# Altium project BEE_BOARD.PrjPcb (part 1 of 2)
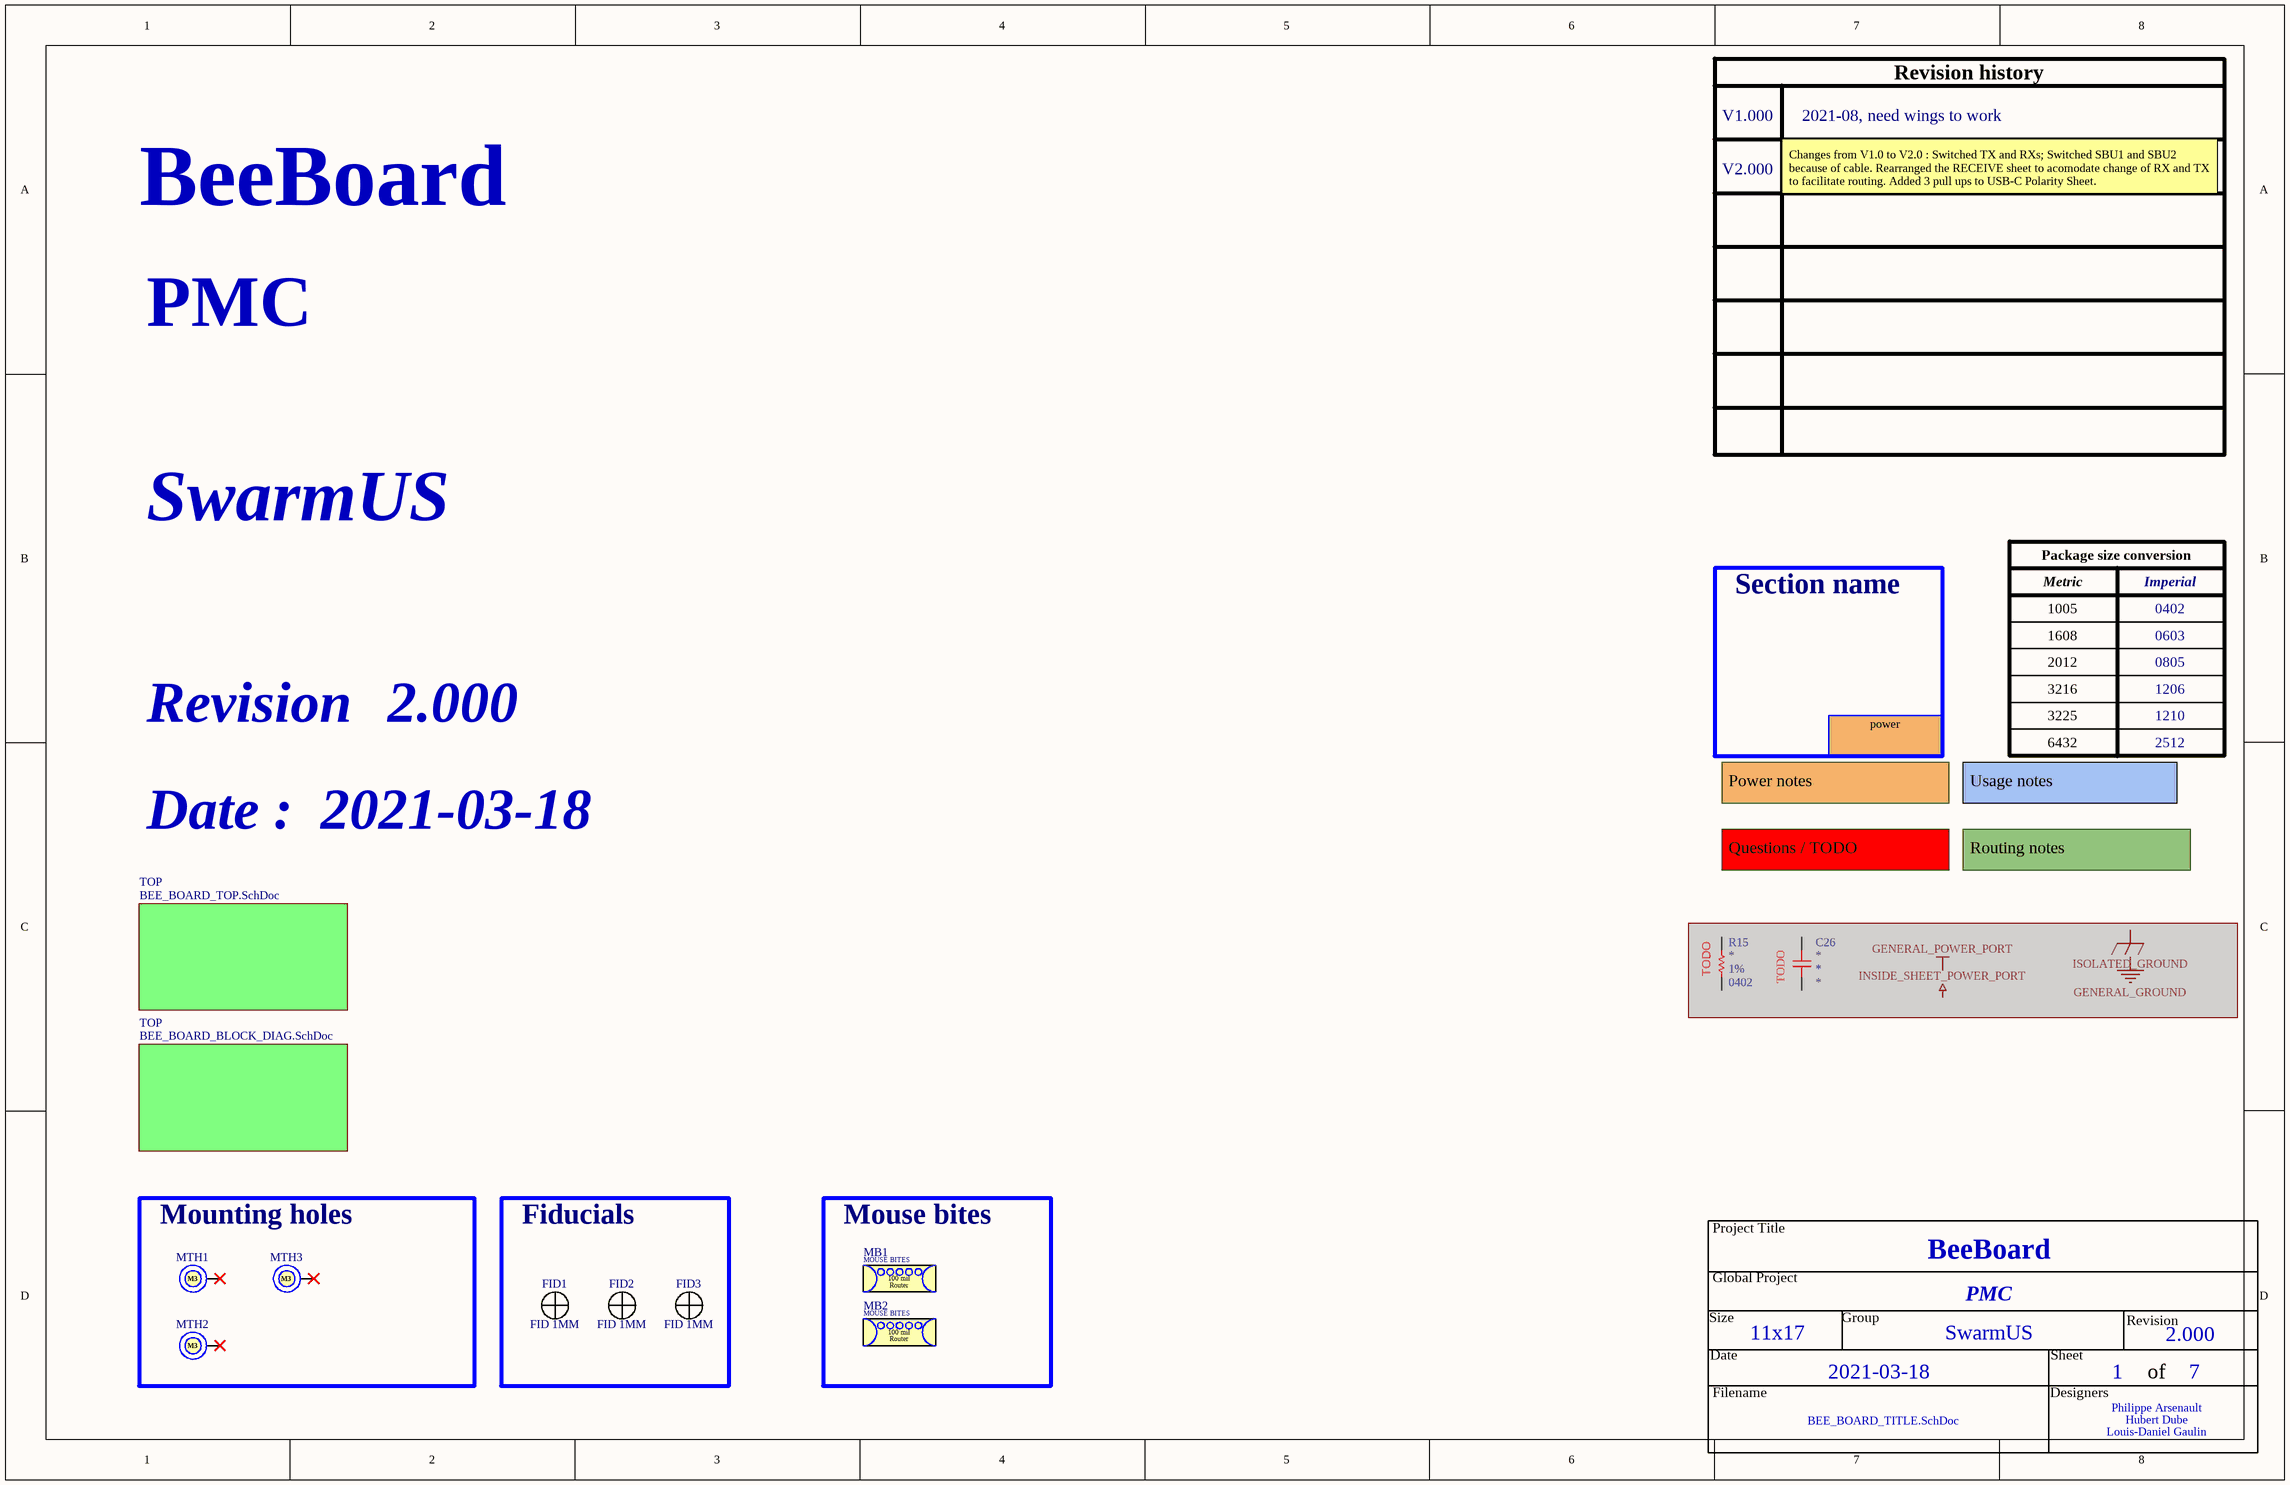
[diagram p0: BEE_BOARD_TITLE.SchDoc]
Project_Stencil_Top_Thickness: 0.1 MM; Project_Stencil_Bot_Thickness: 0.1 MM; Project_Revision: 2.000; Project_Name: BeeBoard; Project_Group: SwarmUS; Project_Global: PMC; Project_Designer3: Louis-Daniel Gaulin; Project_Designer2: Hubert Dube; Project_Designer1: Philippe Arsenault; Project_Date: 2021-03-18
7 sheets, 201 parts. Net scope: hierarchical (ports join the sheet entries above them; power ports are global).
Board file: BEE_BOARD.PcbDoc
Sheets:
  BEE_BOARD_TITLE.SchDoc
    TOP = BEE_BOARD_TOP.SchDoc
      POWER = BEE_BOARD_POWER.SchDoc
      RECEIVE = BEE_BOARD_RECEIVE.SchDoc
      DECAWAVE = BEE_BOARD_DECAWAVE.SchDoc
      POLARITY CHECK = BEE_BOARD_USB_C_POLARITY.SchDoc
    TOP = BEE_BOARD_BLOCK_DIAG.SchDoc

## Sheet BEE_BOARD_TITLE.SchDoc
size Tabloid; DocumentNumber: 1; SheetNumber: 1; SheetTotal: 7; Sheet_Name: Insert name in Document Parameters; Size: 11x17

### Parts
(Parts that share a designator on the sheet are numbered #1, #2 ... from top to bottom, then left to right.)
C26#1  PRELIM  [CAP_CER_1812]  (value not drawn)  (masked out: inside a compile mask, not in the netlist)
FID1  FID 1MM  [FID_CIRCLE_1MM]
FID2  FID 1MM  [FID_CIRCLE_1MM]
FID3  FID 1MM  [FID_CIRCLE_1MM]
MB1  MOUSE BITES  [PNL_MOUSEBITES_100MIL_5-HOLES]  (no BOM)
MB2  MOUSE BITES  [PNL_MOUSEBITES_100MIL_5-HOLES]  (no BOM)
MTH1  M3  [MTH_M3]  (no BOM)
MTH2  M3  [MTH_M3]  (no BOM)
MTH3  M3  [MTH_M3]  (no BOM)
R15#1  Tolerance: 1%  Package: 0402  [RES_0402]  (hidden comment: PRELIM)  (masked out: inside a compile mask, not in the netlist)

### Blocks framed on the sheet
Mounting holes: MTH1-MTH3
Fiducials: FID1-FID3
Mouse bites: MB1 MB2

### Sub-sheets
TOP = BEE_BOARD_TOP.SchDoc: no entries
TOP = BEE_BOARD_BLOCK_DIAG.SchDoc: no entries

### Nets

Not connected (* = marked no-connect by the designer): FID1 1 2; FID2 1 2; FID3 1 2; MTH1 1*; MTH2 1*; MTH3 1*

### Notes on the sheet
- V1.000
- 2021-08, need wings to work
- V2.000
- Changes from V1.0 to V2.0 : Switched TX and RXs; Switched SBU1 and SBU2 because of cable. Rearranged the RECEIVE sheet to acomodate change of RX and TX to facilitate routing. Added 3 pull ups to USB-C Polarity Sheet.
- Section name
- power
- Power notes
- Usage notes
- Questions / TODO
- Routing notes
- Revision history
- Package size conversion
- Metric
- 1005
- 1608
- Imperial
- 0402
- 0603
- Revision
- 2012
- 3216
- 0805
- 1206
- 3225
- 6432
- 1210
- 2512
- Date :
- Project Title
- Global Project
- Size
- Date
- Group
- Sheet
- of
- Filename
- Designers
- (in symbol CAP_CER_PRELIM) TODO
- (in symbol PNL_MOUSEBITES_100MIL_5-HOLES) 100 mil; Router
- (in symbol RES_PRELIM) TODO

### Library data of the parts
C26#1 = CAP_CER_PRELIM: CAP - CER PRELIM; Manufacturer #1: Würth Elektronik; Part Number #1: 885342211009; Tolerance: 10%; GRAMS Lib Spec: 2.8; Magnetic Material: Unknown; Polarized: No; Current Rating: *; Power Max: *; HelpURL: http://www.vishay.com/docs/45228/hvseries.pdf; CreatedBy/Date: Hubert Dube - 03/02/2021; Temperature: -55°C ~ 125°C; Manufacturer #2: *; Note: *; Assembly Type: SMD; Part Number #2: *; Cryo: UNKNOWN; Supplier 1: Digi-Key; Supplier Part Number 1: 732-12109-1-ND; Package: *; Voltage Rating: *; Value: *
FID1-FID3 = FID_CIRCLE_1MM: FID - FIDUCIAL 1MM CIRCLE DOUBLE-SIDED - 1MM; GRAMS Lib Spec: 2.8; Magnetic Material: NO; Cryo: UNKNOWN; Value: *; Tolerance: *; Voltage Rating: *; Current Rating: *; Power Max: *; HelpURL: https://www.pcb-3d.com/wordpress/wp-content/uploads/ipc-sm-782a_amendment_1_and_2.pdf; CreatedBy/Date: Jonathan Bouchard 2018-07-23; VerifiedBy: Caroline Paulin - 25 juillet 2018; Temperature: *; Package: 1MM CIRCLE; Manufacturer #1: *; Manufacturer #2: *; Note: *; Assembly Type: NONE; Part Number #2: *; Part Number #1: *; Polarized: *; Supplier 1: *; Supplier Part Number 1: *
MB1 MB2 = PNL_MOUSEBITES_100MIL_5-HOLES: PNL - MOUSE BITES 100 MIL - 5-TH; GRAMS Lib Spec: 2.8; Magnetic Material: NO; Rule: UNIONINDEX=0|RULEKIND=ComponentClearance|NETSCOPE=AnyNet|LAYERKIND=SameLayer|NAME=Schematic Component Clearance Constraint|GAP=0mil|COLLISIONCHECKMODE=3|VERTICALGAP=0mil|SHOWDISTANCES=FALSE|UNIT=Imperial; Rule: UNIONINDEX=0|RULEKIND=PlaneClearance|NETSCOPE=AnyNet|LAYERKIND=SameLayer|NAME=Schematic Power Plane Clearance|CLEARANCE=20mil|UNIT=Imperial; Cryo: UNKNOWN; Value: *; Tolerance: *; Voltage Rating: *; Current Rating: *; Power Max: *; HelpURL: *; CreatedBy/Date: Jonathan Bouchard 2019-04-15; VerifiedBy: Caroline Paulin - 24 mai 2019; Temperature: *; Package: *; Manufacturer #1: *; Manufacturer #2: *; Note: *; Assembly Type: NONE; Part Number #2: *; Part Number #1: *; Polarized: *; Supplier 1: *; Supplier Part Number 1: *
MTH1-MTH3 = MTH_M3: MTH - MOUNTING HOLE M3 PLATED - M3; GRAMS Lib Spec: 2.8; Magnetic Material: NO; Cryo: UNKNOWN; Value: *; Tolerance: *; Voltage Rating: *; Current Rating: *; Power Max: *; HelpURL: https://littlemachineshop.com/images/gallery/PDF/TapDrillSizes.pdf; CreatedBy/Date: Jonathan Bouchard 2018-07-23; VerifiedBy: Arnaud Samson 23-07-18; Temperature: *; Package: M3; Manufacturer #1: *; Manufacturer #2: *; Note: *; Assembly Type: NONE; Part Number #2: *; Part Number #1: *; Polarized: *; Supplier 1: *; Supplier Part Number 1: *
R15#1 = RES_PRELIM: RES -PRELIM; Manufacturer #1: Yageo; Part Number #1: RC0402FR-0775RL; GRAMS Lib Spec: 2.8c; Power Max: 1/16W; Magnetic Material: Unknown; Polarized: No; Voltage Rating: 50V; Assembly Type: SMD; CreatedBy/Date: Hubert Dubé - 3/02/2020; Current Rating: *; HelpURL: https://www.yageo.com/upload/media/product/productsearch/datasheet/rchip/PYu-RC_Group_51_RoHS_L_11.pdf; Manufacturer #2: *; Note: *; Part Number #2: *; Temperature: -55°C ~ 155°C; Value: *

## Sheet BEE_BOARD_TOP.SchDoc
size Tabloid; DocumentNumber: 3; SheetNumber: 3; SheetTotal: 7; Sheet_Name: Top; Size: 11x17
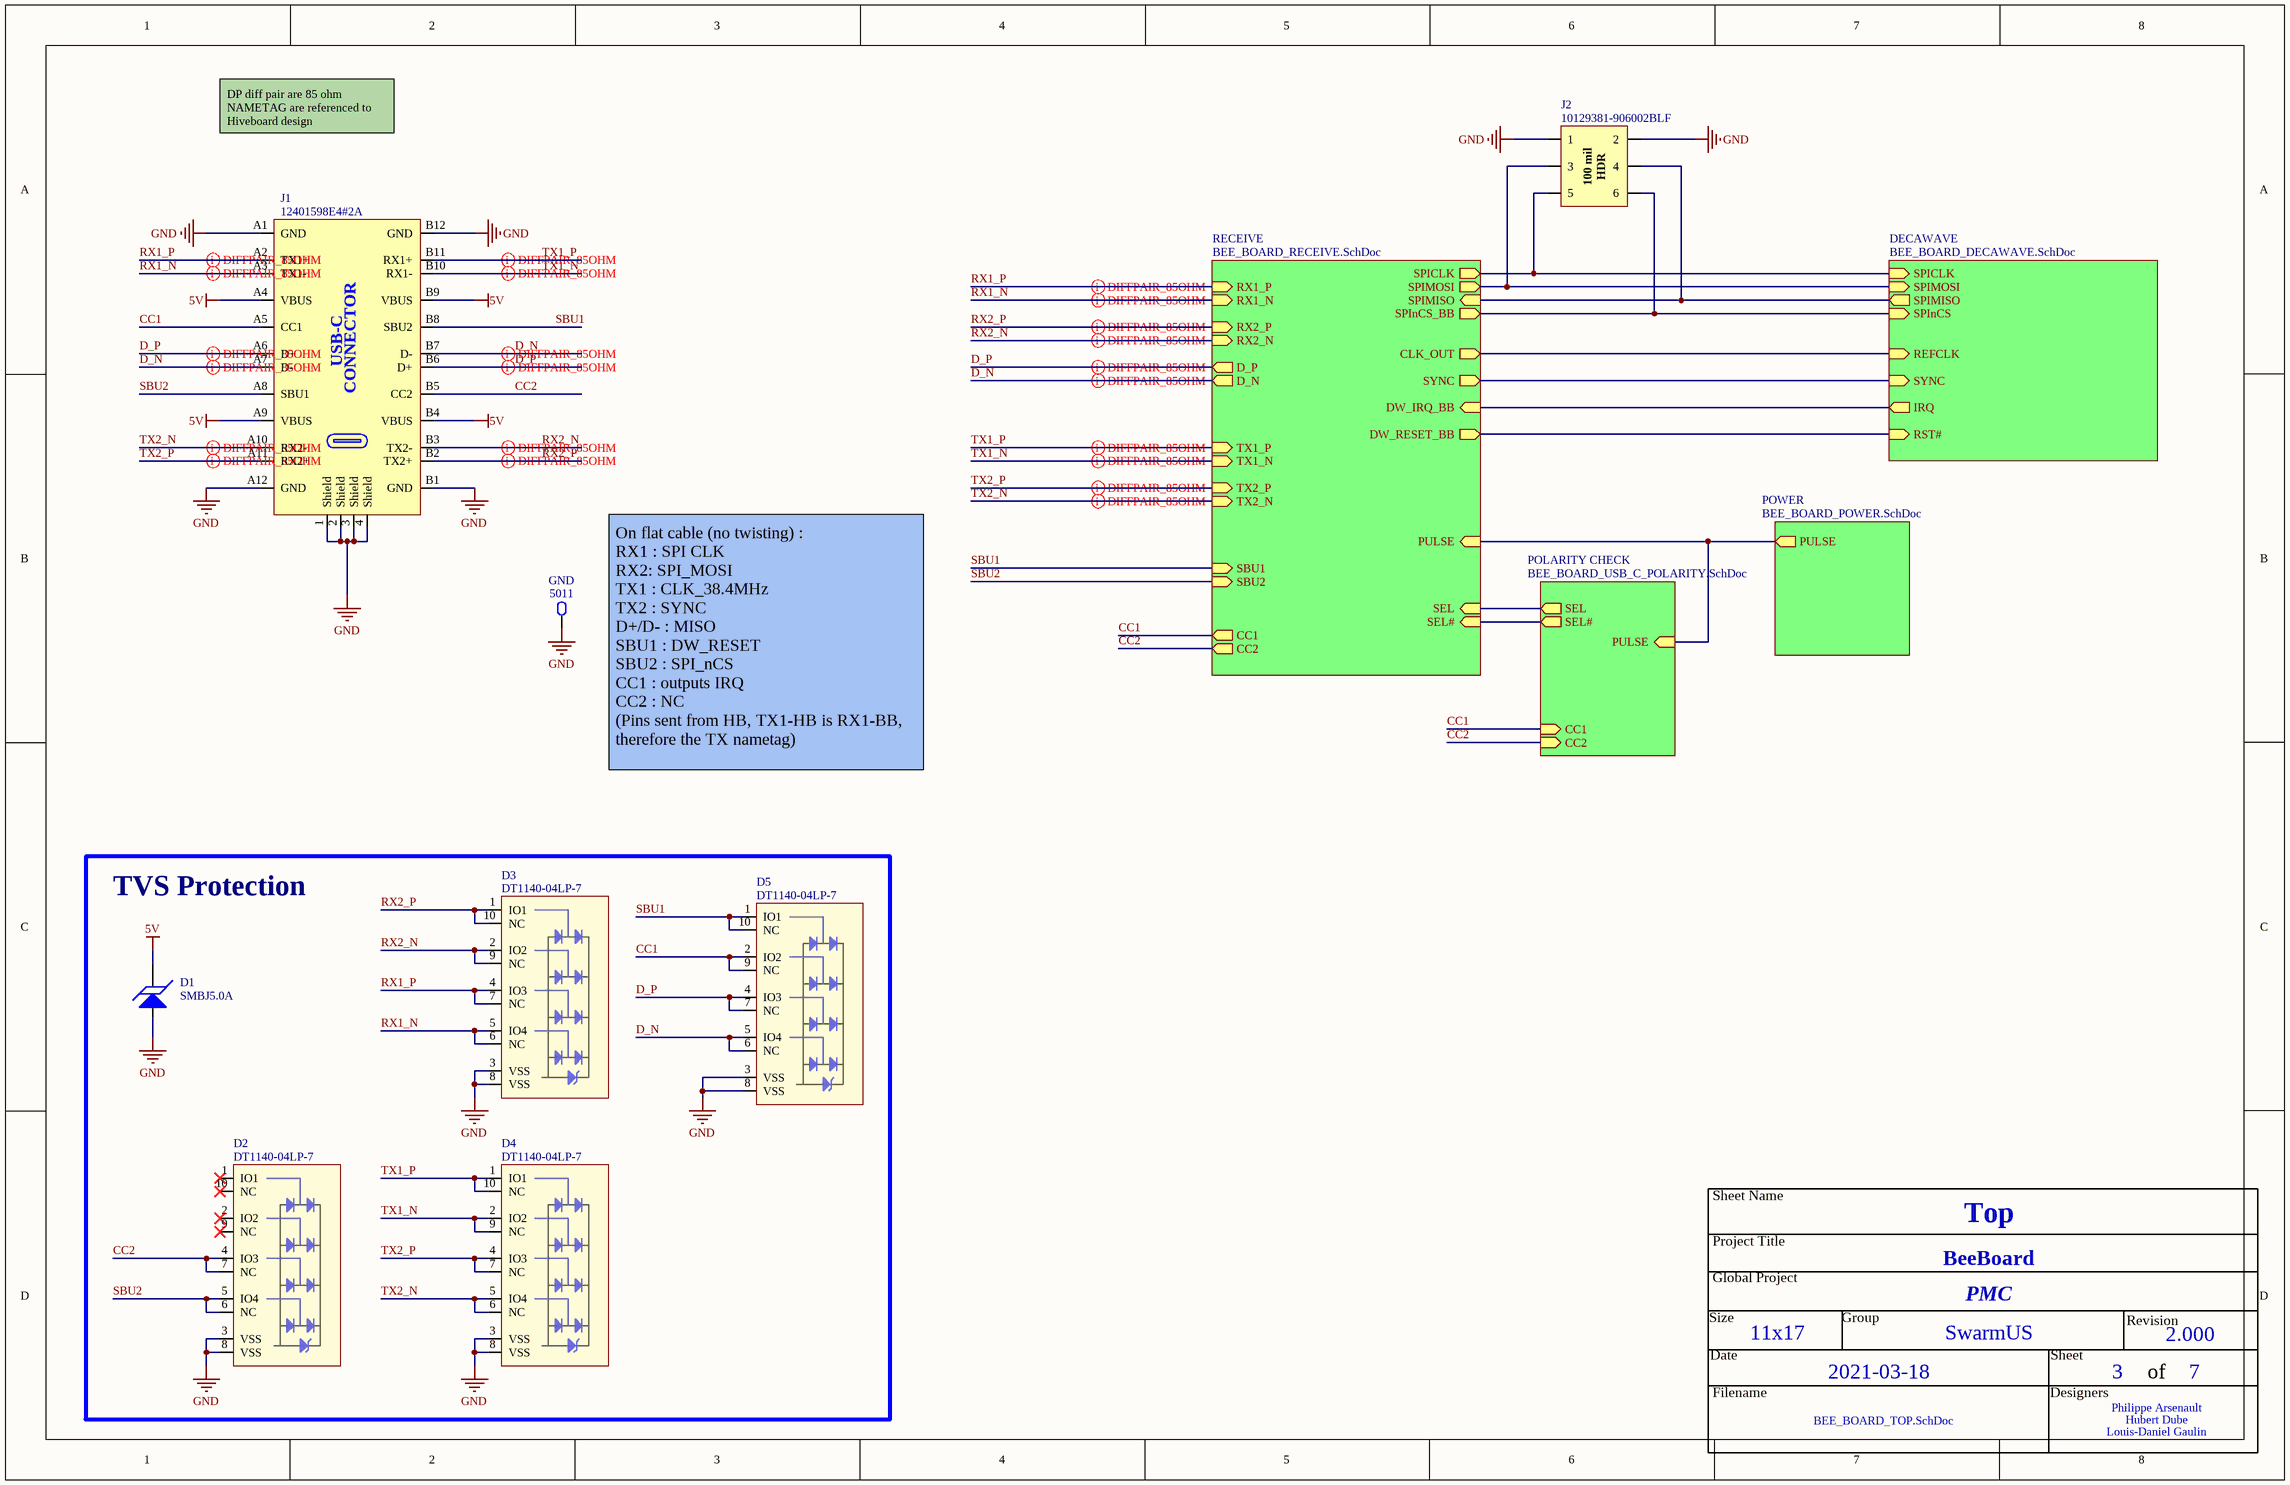
[diagram p1: BEE_BOARD_TOP.SchDoc]

### Parts
D1  SMBJ5.0A  [TVS_PWR_SMBJ5.0CA]
D2  DT1140-04LP-7  [TVS_DATA_DT1140-04LP-7]
D3  DT1140-04LP-7  [TVS_DATA_DT1140-04LP-7]
D4  DT1140-04LP-7  [TVS_DATA_DT1140-04LP-7]
D5  DT1140-04LP-7  [TVS_DATA_DT1140-04LP-7]
GND  5011  [TPO_5011]
J1  12401598E4#2A  [CON_USB_3.2_TypeC_12401598E4#2A]
J2  10129381-906002BLF  [CON_HDR_10129381-906002BLF]

### Blocks framed on the sheet
TVS Protection: D1-D5

### Sub-sheets
DECAWAVE = BEE_BOARD_DECAWAVE.SchDoc: SYNC (in), SPICLK (in), SPIMISO (out), SPIMOSI (in), RST# (in), REFCLK (in), SPInCS (in), IRQ (out)
POLARITY CHECK = BEE_BOARD_USB_C_POLARITY.SchDoc: CC1 (in), CC2 (in), SEL (out), PULSE (in), SEL# (out)
POWER = BEE_BOARD_POWER.SchDoc: PULSE (out)
RECEIVE = BEE_BOARD_RECEIVE.SchDoc: SPIMISO (in), SPIMOSI (out), SPICLK (out), CLK_OUT (out), SYNC (out), DW_IRQ_BB (in), SPInCS_BB (out), DW_RESET_BB (out), CC1 (out), CC2 (out), TX1_P (in), SBU2 (in), SEL (in), TX2_N (in), RX2_P (in), RX1_P (in), TX1_N (in), TX2_P (in), RX2_N (in), RX1_N (in), D_P (out), D_N (out), SBU1 (in), PULSE (in), SEL# (in)

### Nets
5V: D1.1 J1.A4(VBUS) J1.A9(VBUS) J1.B4(VBUS) J1.B9(VBUS)
GND: D1.2 D2.3(VSS) D2.8(VSS) D3.3(VSS) D3.8(VSS) D4.3(VSS) D4.8(VSS) D5.3(VSS) D5.8(VSS) GND.1 J1.1(Shield) J1.2(Shield) J1.3(Shield) J1.4(Shield) J1.A1(GND) J1.A12(GND) J1.B1(GND) J1.B12(GND) J2.1 J2.2
CC1: D5.2(IO2) D5.9(NC) J1.A5(CC1) ; sheet RECEIVE/CC1, sheet POLARITY CHECK/CC1
CC2: D2.4(IO3) D2.7(NC) J1.B5(CC2) ; sheet RECEIVE/CC2, sheet POLARITY CHECK/CC2
CLK_OUT: sheet RECEIVE/CLK_OUT, sheet DECAWAVE/REFCLK
D_N: D5.5(IO4) D5.6(NC) J1.A7(D-) J1.B7(D-) ; sheet RECEIVE/D_N
D_P: D5.4(IO3) D5.7(NC) J1.A6(D+) J1.B6(D+) ; sheet RECEIVE/D_P
DW_IRQ_BB: sheet RECEIVE/DW_IRQ_BB, sheet DECAWAVE/IRQ
DW_RESET_BB: sheet RECEIVE/DW_RESET_BB, sheet DECAWAVE/RST#
PULSE: sheet POWER/PULSE, sheet RECEIVE/PULSE, sheet POLARITY CHECK/PULSE
RX1_N: D3.5(IO4) D3.6(NC) J1.A3(TX1-) ; sheet RECEIVE/RX1_N
RX1_P: D3.4(IO3) D3.7(NC) J1.A2(TX1+) ; sheet RECEIVE/RX1_P
RX2_N: D3.2(IO2) D3.9(NC) J1.B3(TX2-) ; sheet RECEIVE/RX2_N
RX2_P: D3.1(IO1) D3.10(NC) J1.B2(TX2+) ; sheet RECEIVE/RX2_P
SBU1: D5.1(IO1) D5.10(NC) J1.B8(SBU2) ; sheet RECEIVE/SBU1
SBU2: D2.5(IO4) D2.6(NC) J1.A8(SBU1) ; sheet RECEIVE/SBU2
SEL: sheet RECEIVE/SEL, sheet POLARITY CHECK/SEL
SEL#: sheet RECEIVE/SEL#, sheet POLARITY CHECK/SEL#
SPICLK: J2.5 ; sheet RECEIVE/SPICLK, sheet DECAWAVE/SPICLK
SPIMISO: J2.4 ; sheet RECEIVE/SPIMISO, sheet DECAWAVE/SPIMISO
SPIMOSI: J2.3 ; sheet RECEIVE/SPIMOSI, sheet DECAWAVE/SPIMOSI
SPInCS: J2.6 ; sheet RECEIVE/SPInCS_BB, sheet DECAWAVE/SPInCS
SYNC: sheet RECEIVE/SYNC, sheet DECAWAVE/SYNC
TX1_N: D4.2(IO2) D4.9(NC) J1.B10(RX1-) ; sheet RECEIVE/TX1_N
TX1_P: D4.1(IO1) D4.10(NC) J1.B11(RX1+) ; sheet RECEIVE/TX1_P
TX2_N: D4.5(IO4) D4.6(NC) J1.A10(RX2-) ; sheet RECEIVE/TX2_N
TX2_P: D4.4(IO3) D4.7(NC) J1.A11(RX2+) ; sheet RECEIVE/TX2_P

Not connected (* = marked no-connect by the designer): D2 1(IO1)* 2(IO2)* 9(NC)* 10(NC)*

### Layout directives
differential pair; differential pair class DIFF_85: D_N, D_P, RX1_N, RX1_P, RX2_N, RX2_P
differential pair; differential pair class DIFF_85; net class TX: TX1_N, TX1_P, TX2_N, TX2_P

### Notes on the sheet
- DP diff pair are 85 ohm
  NAMETAG are referenced to Hiveboard design
- (near GND) On flat cable (no twisting) :
  RX1 : SPI CLK
  RX2: SPI_MOSI
  TX1 : CLK_38.4MHz
  TX2 : SYNC
  D+/D- : MISO
  SBU1 : DW_RESET
  SBU2 : SPI_nCS
  CC1 : outputs IRQ
  CC2 : NC
  (Pins sent from HB, TX1-HB is RX1-BB, therefore the TX nametag)
- Sheet Name
- Project Title
- Global Project
- Revision
- Size
- Date
- Group
- Sheet
- of
- Filename
- Designers
- (in symbol CON_HDR_10129381-906002BLF) 100 mil; HDR
- (in symbol CON_USB_3.2_TypeC_12401598E4#2A) USB-C; CONNECTOR

### Library data of the parts
D1 = TVS_PWR_SMBJ5.0A: TVS - BIDIR 5V 9.2V 600W - DO214AA; Manufacturer #1: Littelfuse Inc.; Value: Vbr = 6.4V -  Clamp = 9.2V; Voltage Rating: 5V Standoff; Current Rating: 100A (peak); Power Max: 600W (Pppm); GRAMS Lib Spec: 2.8c; Magnetic Material: UNKNOWN; Polarized: YES; Tolerance: *; HelpURL: https://www.littelfuse.com/~/media/electronics/datasheets/tvs_diodes/littelfuse_tvs_diode_smbj_datasheet.pdf.pdf; CreatedBy/Date: Louis-Daniel Gaulin / 13-04-2021; VerifiedBy: Philippe Arsenault/2021-04-14; Temperature: -65°C ~ 150°C (TJ); Package: DO214AA; Manufacturer #2: *; Note: *; Assembly Type: SMD; Part Number #2: *; Part Number #1: SMBJ5.0A; Supplier 1: Digi-Key; Supplier Part Number 1: SMBJ5.0ALFCT-ND; Cryo: UNKNOWN
D2-D5 = TVS_DATA_DT1140-04LP-7: TVS - DIODE 5.5V 10V - 10-UFDFN; Manufacturer #1: Diodes Incorporated; Value: 5.5V @ 1mA (Reverse Standoff); Voltage Rating: 6V (Breakdown); Current Rating: 6A (8/20µs); Power Max: 60W (8/20µs); GRAMS Lib Spec: 2.8; Note: Fooprint created from tpd4e05u06 (TI) for manufacturability (soldermask); Magnetic Material: Unknown; Polarized: Yes; Tolerance: -; HelpURL: https://www.diodes.com/assets/Datasheets/DT1140-04LP.pdf; CreatedBy/Date: Joël Lemay 2019-11-20; VerifiedBy: C.Paulin - 21/11/2019; Temperature: -55°C~85°C; Package: 10-UFDFN; Manufacturer #2: -; Assembly Type: SMD; Part Number #2: -; Part Number #1: DT1140-04LP-7; Supplier 1: Digi-Key; Supplier Part Number 1: DT1140-04LP-7DICT-ND; Cryo: UNKNOWN
GND = TPO_5011: TPO - TEST POINT - TH; Manufacturer #1: Keystone Electronics; Polarized: No; Magnetic Material: UNKNOWN; GRAMS Lib Spec: 2.8; Current Rating: *; Manufacturer #2: *; Note: *; Power Max: *; Value: *; Part Number #1: 5011; Part Number #2: *; HelpURL: https://www.keyelco.com/userAssets/file/M65p56.pdf; Assembly Type: TH; Package: *; CreatedBy/Date: Louis-Daniel Gauli / 02-11-2020; Temperature: *; Tolerance: *; VerifiedBy: Philippe Arsenault/2020-11-06; Voltage Rating: *; Cryo: UNKNOWN; Supplier 1: Digi-Key; Supplier Part Number 1: 36-5011-ND
J1 = CON_USB_3.2_TypeC_12401598E4#2A: CON_USB - USB 3.2 Gen 2 (USB 3.1 Gen 2, Superspeed + (USB 3.1)) 24 pos Receptacle - R/A; Manufacturer #1: Amphenol ICC (Commercial Products); Value: USB 3.2 Type C; Current Rating: 5A total; GRAMS Lib Spec: 2.8; Magnetic Material: Unknown; Polarized: Yes; Voltage Rating: -; Power Max: -; HelpURL: https://www.amphenol-icc.com/media/wysiwyg/files/drawing/12401598xxx2a.pdf; CreatedBy/Date: Louis-Daniel Gaulin / 07-04-2021; VerifiedBy: Philippe Arsenault/2021-04-08; Temperature: max 105°C; Package: SMD + TH R/A; Assembly Type: SMD + TH; Part Number #1: 12401598E4#2A; Supplier 1: Digi-Key; Supplier Part Number 1: 12401598E4#2ACT-ND
J2 = CON_HDR_10129381-906002BLF: CON - Header 6 positions 3x2  0.100" - 6-TH; Manufacturer #1: Amphenol ICC (FCI); Current Rating: 3A; GRAMS Lib Spec: 2.8c; Magnetic Material: Unknown; Polarized: Yes; Value: 6 Pos.; Assembly Type: TH; CreatedBy/Date: Philippe Arsenault/2021-04-14; HelpURL: https://cdn.amphenol-icc.com/media/wysiwyg/files/drawing/10129381.pdf; Manufacturer #2: *; Package: 6- TH; Part Number #2: *; Power Max: *; Temperature: -55°C ~ 105°C; Tolerance: *; Part Number #1: 10129381-906002BLF; Cryo: UNKNOWN; Supplier 1: Digi-Key; Supplier Part Number 1: 10129381-906002BLF-ND

## Sheet BEE_BOARD_POWER.SchDoc
size Tabloid; DocumentNumber: 4; SheetNumber: 4; SheetTotal: 7; Sheet_Name: POWER; Size: 11x17
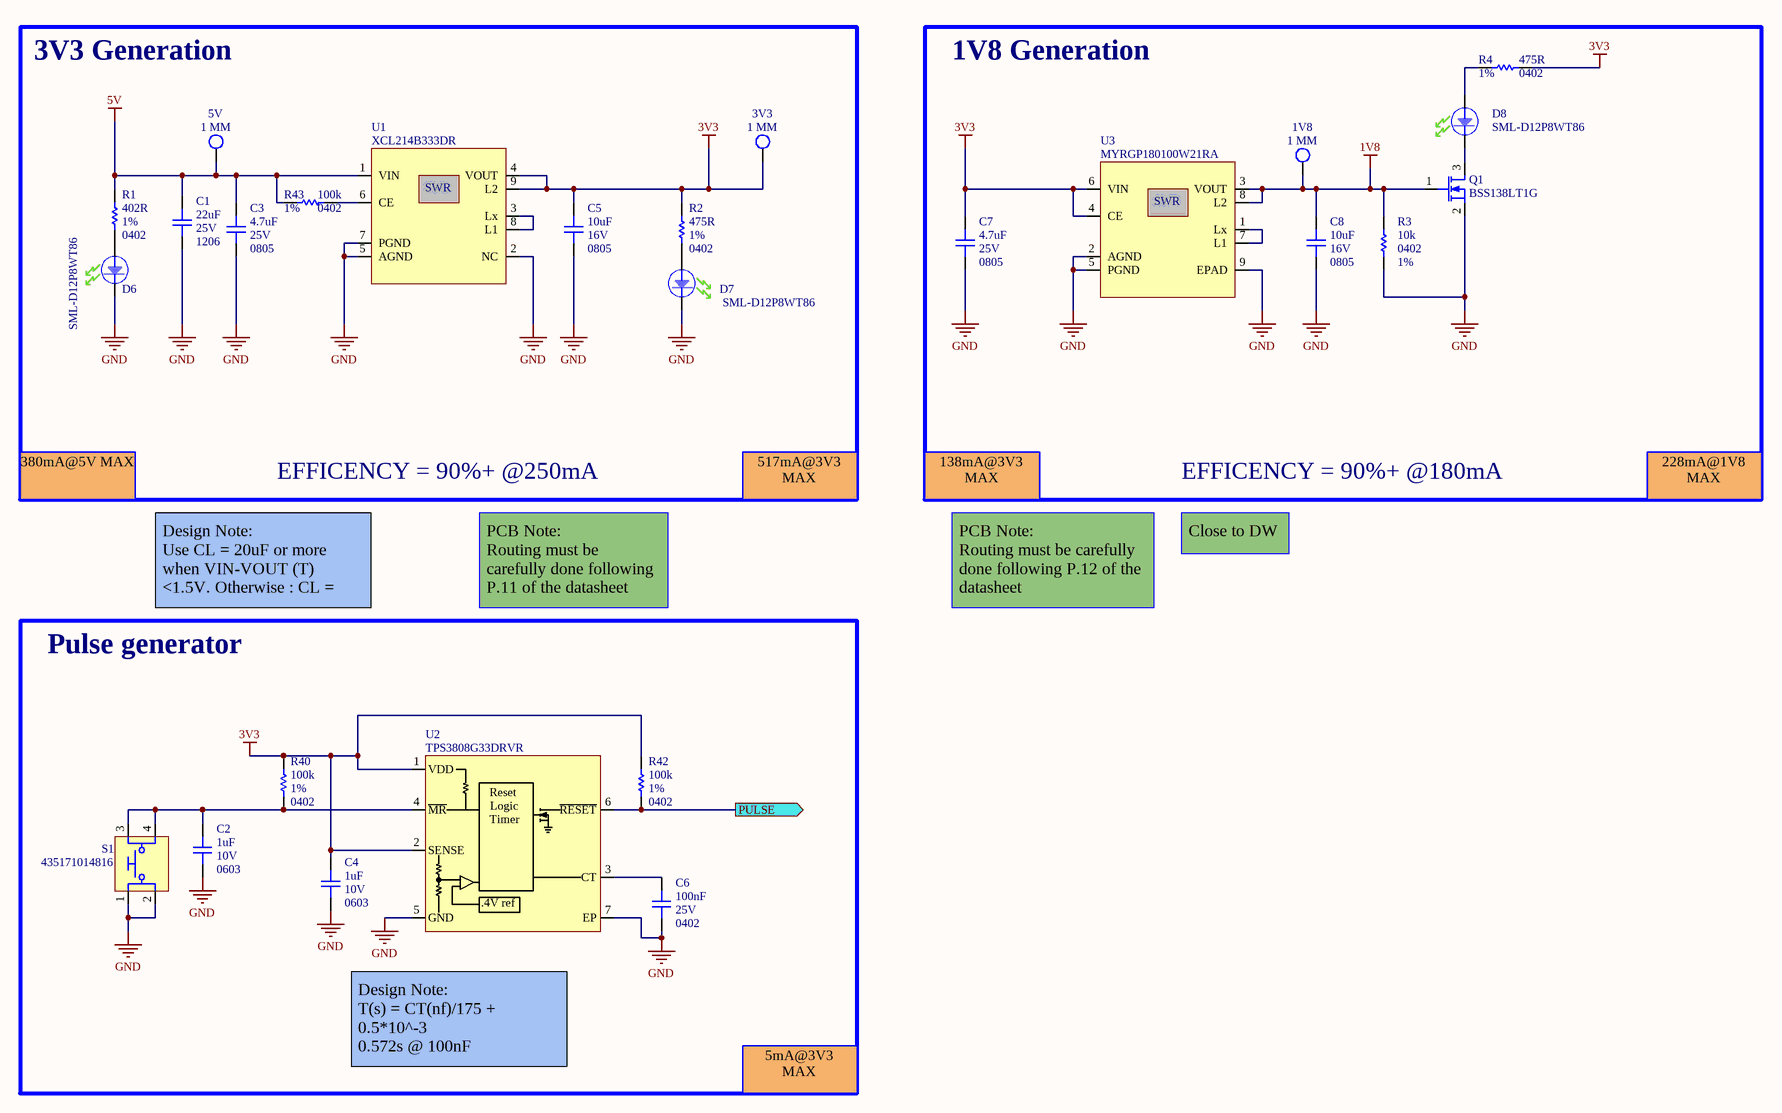
[diagram p2: BEE_BOARD_POWER.SchDoc]

### Parts
1V8  1 MM  [TPO_SMD_ROUND_1MM]  (no BOM)
3V3  1 MM  [TPO_SMD_ROUND_1MM]  (no BOM)
5V  1 MM  [TPO_SMD_ROUND_1MM]  (no BOM)
C1  value 22uF  Package: 1206  Voltage Rating: 25V  [CAP_CER_1206]  (hidden comment: CL31A226KAHNNNE)
C2  value 1uF  Package: 0603  Voltage Rating: 10V  [CAP_CER_0603]  (hidden comment: C0603C105K8PACTU)
C3  value 4.7uF  Package: 0805  Voltage Rating: 25V  [CAP_CER_0805]  (hidden comment: C2012X7R1E475K125AE)
C4  value 1uF  Package: 0603  Voltage Rating: 10V  [CAP_CER_0603]  (hidden comment: C0603C105K8PACTU)
C5  value 10uF  Package: 0805  Voltage Rating: 16V  [CAP_CER_0805]  (hidden comment: GRM21BR61C106KE15K)
C6  value 100nF  Package: 0402  Voltage Rating: 25V  [CAP_CER_0402]  (hidden comment: CGA2B3X7R1E104K050BB)
C7  value 4.7uF  Package: 0805  Voltage Rating: 25V  [CAP_CER_0805]  (hidden comment: C2012X7R1E475K125AE)
C8  value 10uF  Package: 0805  Voltage Rating: 16V  [CAP_CER_0805]  (hidden comment: GRM21BR61C106KE15K)
D6  SML-D12P8WT86  [LED_SML-D12P8WT86]
D7  SML-D12P8WT86  [LED_SML-D12P8WT86]
D8  SML-D12P8WT86  [LED_SML-D12P8WT86]
Q1  BSS138LT1G  [TRX_NMOS_BSS138LT1G]
R1  value 402R  Tolerance: 1%  Package: 0402  [RES_0402]  (hidden comment: ERJ-2RKF4020X)
R2  value 475R  Tolerance: 1%  Package: 0402  [RES_0402]  (hidden comment: ERJ-2RKF4750X)
R3  value 10k  Tolerance: 1%  Package: 0402  [RES_0402]  (hidden comment: RC0402FR-0710KL)
R4  value 475R  Tolerance: 1%  Package: 0402  [RES_0402]  (hidden comment: ERJ-2RKF4750X)
R40  value 100k  Tolerance: 1%  Package: 0402  [RES_0402]  (hidden comment: RC0402FR-07100KL)
R42  value 100k  Tolerance: 1%  Package: 0402  [RES_0402]  (hidden comment: RC0402FR-07100KL)
R43  value 100k  Tolerance: 1%  Package: 0402  [RES_0402]  (hidden comment: RC0402FR-07100KL)
S1  435171014816  [SWI_TACT_435171014816]
U1  XCL214B333DR  [REG_SWR_XCL214B333DR]
U2  TPS3808G33DRVR  [POW_TPS3808G33DRVR]
U3  MYRGP180100W21RA  [REG_SWR_MYRGP180100W21RA]

### Blocks framed on the sheet
3V3 Generation: 3V3 5V C1 C3 C5 D6 D7 R1 R2 R43 U1
1V8 Generation: 1V8 C7 C8 D8 Q1 R3 R4 U3
Pulse generator: C2 C4 C6 R40 R42 S1 U2

### Ports
PULSE (out)

### Nets
1V8: 1V8.1 C8.2 Q1.1(G) R3.1 U3.3(VOUT) U3.8(L2)
3V3: 3V3.1 C4.1 C5.2 C7.2 R2.2 R4.1 R40.2 R42.2 U1.4(VOUT) U1.9(L2) U2.1(VDD) U2.2(SENSE) U3.4(CE) U3.6(VIN)
5V: 5V.1 C1.2 C3.2 R1.2 R43.2 U1.1(VIN)
GND: C1.1 C2.2 C3.1 C4.2 C5.1 C6.1 C7.1 C8.1 D6.K D7.K Q1.2(S) R3.2 S1.1 S1.2 U1.2(NC) U1.5(AGND) U1.7(PGND) U2.5(GND) U2.7(EP) U3.2(AGND) U3.5(PGND) U3.9(EPAD)
PULSE: R42.1 U2.6(~{RESET}) ; port PULSE
NetC2_1: C2.1 R40.1 S1.3 S1.4 U2.4(~{MR})
NetC6_2: C6.2 U2.3(CT)
NetD6_A: D6.A R1.1
NetD7_A: D7.A R2.1
NetD8_A: D8.A R4.2
NetD8_K: D8.K Q1.3(D)
NetR43_1: R43.1 U1.6(CE)
NetU1_3: U1.3(Lx) U1.8(L1)
NetU3_1: U3.1(Lx) U3.7(L1)

### Notes on the sheet
- 380mA@5V MAX
- EFFICENCY = 90%+ @250mA
- 517mA@3V3 MAX
- 138mA@3V3 MAX
- EFFICENCY = 90%+ @180mA
- 228mA@1V8 MAX
- Design Note:
  Use CL = 20uF or more when VIN-VOUT (T) <1.5V. Otherwise : CL = 10uF
- PCB Note:
  Routing must be carefully done following P.11 of the datasheet
- PCB Note:
  Routing must be carefully done following P.12 of the datasheet
- Close to DW
- Design Note:
  T(s) = CT(nf)/175 + 0.5*10^-3
  0.572s @ 100nF
- 5mA@3V3
  MAX
- Sheet Name
- Project Title
- Global Project
- Size
- Group
- Revision
- Date
- Sheet
- of
- Filename
- Designers
- (in symbol POW_TPS3808G33DRVR) Reset; Logic; Timer; .4V ref
- (in symbol REG_SWR_MYRGP180100W21RA) SWR
- (in symbol REG_SWR_XCL214B333DR) SWR

### Library data of the parts
1V8 3V3 5V = TPO_SMD_ROUND_1MM: TPO - TEST POINT ROUND SMD PAD ONLY  - 1 MM; Magnetic Material: NO; GRAMS Lib Spec: 2.8; Cryo: UNKNOWN; Current Rating: *; Manufacturer #1: *; Manufacturer #2: *; Note: *; Power Max: *; Value: *; Part Number #1: *; Part Number #2: *; HelpURL: *; Polarized: *; Supplier 1: *; Assembly Type: NONE; Supplier Part Number 1: *; Package: 1 MM ROUND; CreatedBy/Date: Jonathan Bouchard 2018-07-17; Temperature: *; Tolerance: *; VerifiedBy: Arnaud Samson 23-07-18; Voltage Rating: *
C1 = CAP_CER_CL31A226KAHNNNE: CAP - CER 22uF 10% 25V X5R - 1206; Manufacturer #1: Samsung Electro-Mechanics; GRAMS Lib Spec: 2.8; Magnetic Material: Unknown; Polarized: NO; Assembly Type: SMD; CreatedBy/Date: Philippe Arsenault/21 Janvier 2020; Current Rating: *; HelpURL: http://www.samsungsem.com/global/support/product-search/mlcc/1207445_4880.html; Manufacturer #2: *; Note: *; Part Number #1: CL31A226KAHNNNE; Part Number #2: 1276-3047-1-ND; Power Max: *; Temperature: -55°C ~ 85°C; Tolerance: 10%; VerifiedBy: C.Paulin - 28/01/2020; Supplier 1: Digi-Key; Supplier Part Number 1: 1276-3047-1-ND; Cryo: UNKNOWN
C2 C4 = CAP_CER_C0603C105K8PACTU: CAP - CER 1uF 10V 10% X5R - 0603; Manufacturer #1: KEMET; GRAMS Lib Spec: 2.8; Magnetic Material: Unknown; Polarized: NO; Tolerance: 10%; Current Rating: *; Power Max: *; HelpURL: https://content.kemet.com/datasheets/KEM_C1006_X5R_SMD.pdf; CreatedBy/Date: Hubert Dube - 21/07/20; VerifiedBy: Louis-Daniel Gaulin - 21/07/20; Temperature: -55°C ~ 85°C; Manufacturer #2: *; Assembly Type: SMD; Part Number #2: *; Part Number #1: C0603C105K8PACTU; Cryo: UNKNOWN; Supplier 1: Digi-Key; Supplier Part Number 1: 399-3118-1-ND
C3 C7 = CAP_CER_C2012X7R1E475K125AE: CAP - CER 4.7UF 10% 25V X7R - 0805; Manufacturer #1: TDK Corporation; GRAMS Lib Spec: 2.8; Magnetic Material: Unknown; Polarized: No; Tolerance: 10%; Current Rating: *; Power Max: *; HelpURL: https://product.tdk.com/info/en/documents/chara_sheet/C2012X7R1E475K125AE.pdf; CreatedBy/Date: Keven Deslandes - 2018/11/09; VerifiedBy: Nicolas Roy - 2018/12/11; Temperature: -55°C ~ 125°C; Manufacturer #2: *; Note: *; Assembly Type: SMD; Part Number #2: *; Part Number #1: C2012X7R1E475K125AE; Supplier 1: Digi-Key; Supplier Part Number 1: 445-14537-1-ND; Cryo: UNKNOWN
C5 C8 = CAP_CER_GRM21BR61C106KE15K: CAP - CER 10UF 10% 16V X5R - 0805; Manufacturer #1: Murata; GRAMS Lib Spec: 2.8; Magnetic Material: Unknown; Polarized: NO; Assembly Type: SMD; CreatedBy/Date: Caroline Paulin / 8 août 2018; Current Rating: *; HelpURL: https://search.murata.co.jp/Ceramy/image/img/A01X/G101/ENG/GRM21BR61C106KE15-01.pdf; Manufacturer #2: *; Note: *; Part Number #1: GRM21BR61C106KE15K; Part Number #2: *; Power Max: *; Temperature: -55°C ~ 85°C; Tolerance: 10%; VerifiedBy: Nicolas V. (2019-01-22); Supplier 1: Digi-Key; Supplier Part Number 1: 490-6473-1-ND; Cryo: UNKNOWN
C6 = CAP_CER_CGA2B3X7R1E104K050BB: CAP - CER 0.1µF 10% 25V X7R - 0402; Manufacturer #1: TDK Corporation; GRAMS Lib Spec: 2.8; Magnetic Material: Unknown; Polarized: NO; Assembly Type: SMD; CreatedBy/Date: Nicolas Roy 2018-11-07; Current Rating: *; HelpURL: https://product.tdk.com/info/en/catalog/datasheets/mlcc_automotive_general_en.pdf; Manufacturer #2: *; Note: *; Part Number #1: CGA2B3X7R1E104K050BB; Part Number #2: *; Power Max: *; Temperature: -55°C ~ 125°C; Tolerance: 10%; VerifiedBy: Nicolas V. (2019-01-22); Supplier 1: Digi-Key; Supplier Part Number 1: 445-6902-1-ND; Cryo: UNKNOWN
D6-D8 = LED_SML-D12P8WT86: LED - GREEN DIFFUSED 0603 SMD - 0603; Manufacturer #1: Rohm Semiconductor; Current Rating: 1-20mA; Note: Operate at 2mA; Value: 560 nm (green); Voltage rating: 2.2V (Forward), 5V (max Reverse); Polarized: Yes; Magnetic Material: Unknown; GRAMS Lib Spec: 2.8; Manufacturer #2: *; Power Max: *; Part Number #1: SML-D12P8WT86; Part Number #2: *; HelpURL: https://d1d2qsbl8m0m72.cloudfront.net/en/products/databook/datasheet/opto/led/chip_mono/sml-d12x8_d13x8-e.pdf; Supplier 1: Digi-Key; Supplier Part Number 1: 511-1579-2-ND; Assembly Type: SMD; Temperature: -40 ~ 85 °C; Package: 0603; CreatedBy/Date: Keven Deslandes - 2018/11/21; Tolerance: *; VerifiedBy: Caroline Paulin - 13 février 2019; Cryo: UNKNOWN
Q1 = TRX_NMOS_BSS138LT1G: TRX - NMOS - 50V 200MA - SOT−23-3; Manufacturer #1: ON Semiconductor; GRAMS Lib Spec: 2.8; Magnetic Material: Unknown; Polarized: Yes; Power Max: 225mW; Assembly Type: SMD; CreatedBy/Date: Joel Lemay 2018-06-15; Current Rating: 200mA; HelpURL: http://www.onsemi.com/pub/Collateral/BSS138LT1-D.PDF; Manufacturer #2: *; Package: SOT-23-3; Part Number #1: BSS138LT1G; Part Number #2: *; Supplier 1: Digi-Key; Supplier Part Number 1: BSS138LT1GOSCT-ND; Temperature: -55°C ~ 150°C; Tolerance: *; Value: *; VerifiedBy: Caroline Paulin - 6 sept 2018; Voltage Rating: 50V; Cryo: UNKNOWN
R1 = RES_ERJ-2RKF4020X: RES - 402R 1% 1/10W - 0402; Manufacturer #1: Panasonic Electronic Components; GRAMS Lib Spec: 2.8; Magnetic Material: Unknown; Polarized: No; Voltage Rating: 50V; Assembly Type: SMD; CreatedBy/Date: Keven Deslandes 2018-09-20; Current Rating: *; HelpURL: https://industrial.panasonic.com/ww/products/resistors/chip-resistors/general-purpose-chip-resistors/precision-thick-film-chip-resistors/ERJ2RKF4020X; Manufacturer #2: *; Part Number #1: ERJ-2RKF4020X; Part Number #2: *; Power Max: 1/10W; Temperature: -55°C ~ 155°C; VerifiedBy: Caroline Paulin - 18/12/2018; Supplier 1: Digi-Key; Supplier Part Number 1: P402LCT-ND; Cryo: UNKNOWN
R2 R4 = RES_ERJ-2RKF4750X: RES - 475R 1% 1/10W- 0402; Manufacturer #1: Panasonic Electronic Components; GRAMS Lib Spec: 2.8; Power Max: 1/10W; Magnetic Material: Unknown; Polarized: No; Voltage Rating: 50V; Assembly Type: SMD; CreatedBy/Date: Keven Deslandes 2018-10-17; Current Rating: *; HelpURL: https://industrial.panasonic.com/cdbs/www-data/pdf/RDA0000/AOA0000C304.pdf; Manufacturer #2: *; Part Number #1: ERJ-2RKF4750X; Part Number #2: *; Temperature: -55°C ~ 155°C; VerifiedBy: Carolilne Paulin - 18/12/2018; Supplier 1: Digi-Key; Supplier Part Number 1: P475LCT-ND; Cryo: UNKNOWN
R3 = RES_RC0402FR-0710KL: RES - 10K OHMS 1% 1/16W - 0402; Manufacturer #1: Yageo; GRAMS Lib Spec: 2.8; Magnetic Material: UNKNOWN; Polarized: NO; Voltage Rating: 50V; Assembly Type: SMD; CreatedBy/Date: Nicolas V. (2018-11-20); Current Rating: *; HelpURL: http://www.yageo.com/documents/recent/PYu-RC_Group_51_RoHS_L_9.pdf; Manufacturer #2: *; Note: *; Part Number #1: RC0402FR-0710KL; Part Number #2: *; Power Max: 1/16W; Temperature: -55°C ~ 155°C; VerifiedBy: Nicolas V. (2018-11-20); Supplier 1: Digi-Key; Supplier Part Number 1: 311-10.0KLRCT-ND; Cryo: UNKNOWN
R40 R42 R43 = RES_RC0402FR-07100KL: RES - 100K 1% 1/16W - 0402; Manufacturer #1: Yageo; GRAMS Lib Spec: 2.8; Magnetic Material: Unknown; Polarized: No; Voltage Rating: 50V; Assembly Type: SMD; CreatedBy/Date: Keven Deslandes 2018-10-19; Current Rating: *; HelpURL: http://www.yageo.com/documents/recent/PYu-RC_Group_51_RoHS_L_9.pdf; Manufacturer #2: *; Part Number #1: RC0402FR-07100KL; Part Number #2: *; Power Max: 1/16W; Temperature: -55°C ~ 155°C; VerifiedBy: Caroline Paulin - 18/12/2018; Supplier 1: Digi-Key; Supplier Part Number 1: 311-100KLRCT-ND; Cryo: UNKNOWN
S1 = SWI_TACT_435171014816: SWI - SWITCH TACTILE SPST-NO 0.05A 12V -SMD; Manufacturer #1: Würth Elektronik; Current Rating: 50mA; Voltage rating: 12VDC; Polarized: No; Magnetic Material: UNKNOWN; GRAMS Lib Spec: 2.8; Manufacturer #2: *; Power Max: *; Value: SPST-NO; Part Number #1: 435171014816; Part Number #2: *; HelpURL: https://www.we-online.com/catalog/datasheet/435171014816.pdf; Supplier 1: Digi-Key; Supplier Part Number 1: 732-435171014816CT-ND; Assembly Type: SMD; Temperature: -40°C ~ 85°C; Package: SMD; CreatedBy/Date: Hubert Dube - 22/07/20; Tolerance: *; VerifiedBy: Louis-Daniel Gaulin / 12-11-2020; Cryo: UNKNOWN
U1 = REG_SWR_XCL214B333DR: REG_DC DC CONVERTER 3.3V 5W_9-PowerTFQFN; Manufacturer #1: Torex Semiconductor Ltd; Voltage Rating: 2.7V to 5.5V IN; Current Rating: 1.5A; GRAMS Lib Spec: 2.8; Magnetic Material: Unknown; Polarized: Yes; Value: 3.3V; Tolerance: *; Power Max: *; HelpURL: https://www.torexsemi.com/file/xcl213/XCL213-XCL214.pdf; CreatedBy/Date: Louis-Daniel Gaulin / 21-07-2020; VerifiedBy: Philippe Arsenault/2020-11-06; Temperature: -40°C ~ 105°C; Package: 9-PowerTFQFN; Manufacturer #2: *; Note: *; Assembly Type: SMD; Part Number #2: *; Part Number #1: XCL214B333DR; Supplier 1: Digi-Key; Supplier Part Number 1: 893-1218-1-ND; Cryo: UNKNOWN
U2 = POW_TPS3808G33DRVR: POW - Programmable-Delay Supervisory Circuit Open Drain - 6WSON; Manufacturer #1: Texas Instruments; Voltage Rating: 1.7V ~ 6.5V (VDD); 3.07V TH; Current Rating: 2.4uA; GRAMS Lib Spec: 2.8; Magnetic Material: Unknown; Polarized: Yes; Value: *; Tolerance: *; Power Max: *; HelpURL: http://www.ti.com/lit/ds/symlink/tps3808.pdf; CreatedBy/Date: Philippe Arsenault/2021-04-19; VerifiedBy: Louis-Daniel Gaulin / 29-04-2021; Temperature: -40°C ~ 125°C; Package: 6-WSON; Manufacturer #2: *; Assembly Type: SMD; Part Number #2: *; Part Number #1: TPS3808G33DRVR; Cryo: UNKNOWN; Supplier 1: Digi-Key; Supplier Part Number 1: 296-36792-1-ND
U3 = REG_SWR_MYRGP180100W21RA: REG_DC DC CONVERTER 1.8V 1.8W_8-PowerTDFN; Manufacturer #1: Murata Power Solutions Inc.; Voltage Rating: 2.5V to 5.5V IN; Current Rating: 1A; GRAMS Lib Spec: 2.8; Magnetic Material: Unknown; Polarized: Yes; Value: 1.8V; Tolerance: *; Power Max: *; HelpURL: https://www.murata.com/products/productdata/8807036026910/MYRGP-b-w.pdf?1583754814000; CreatedBy/Date: Louis-Daniel Gaulin / 21-07-2020; VerifiedBy: Philippe Arsenault/2020-11-06; Temperature: -40°C~105°C; Package: 8-PowerTDFN; Manufacturer #2: *; Note: *; Assembly Type: SMD; Part Number #2: *; Part Number #1: MYRGP180100W21RA; Supplier 1: Digi-Key; Supplier Part Number 1: 811-MYRGP180100W21RACT-ND; Cryo: UNKNOWN

## Sheet BEE_BOARD_RECEIVE.SchDoc
size Tabloid; DocumentNumber: 5; SheetNumber: 5; SheetTotal: 7; Sheet_Name: Receive modules; Size: 11x17
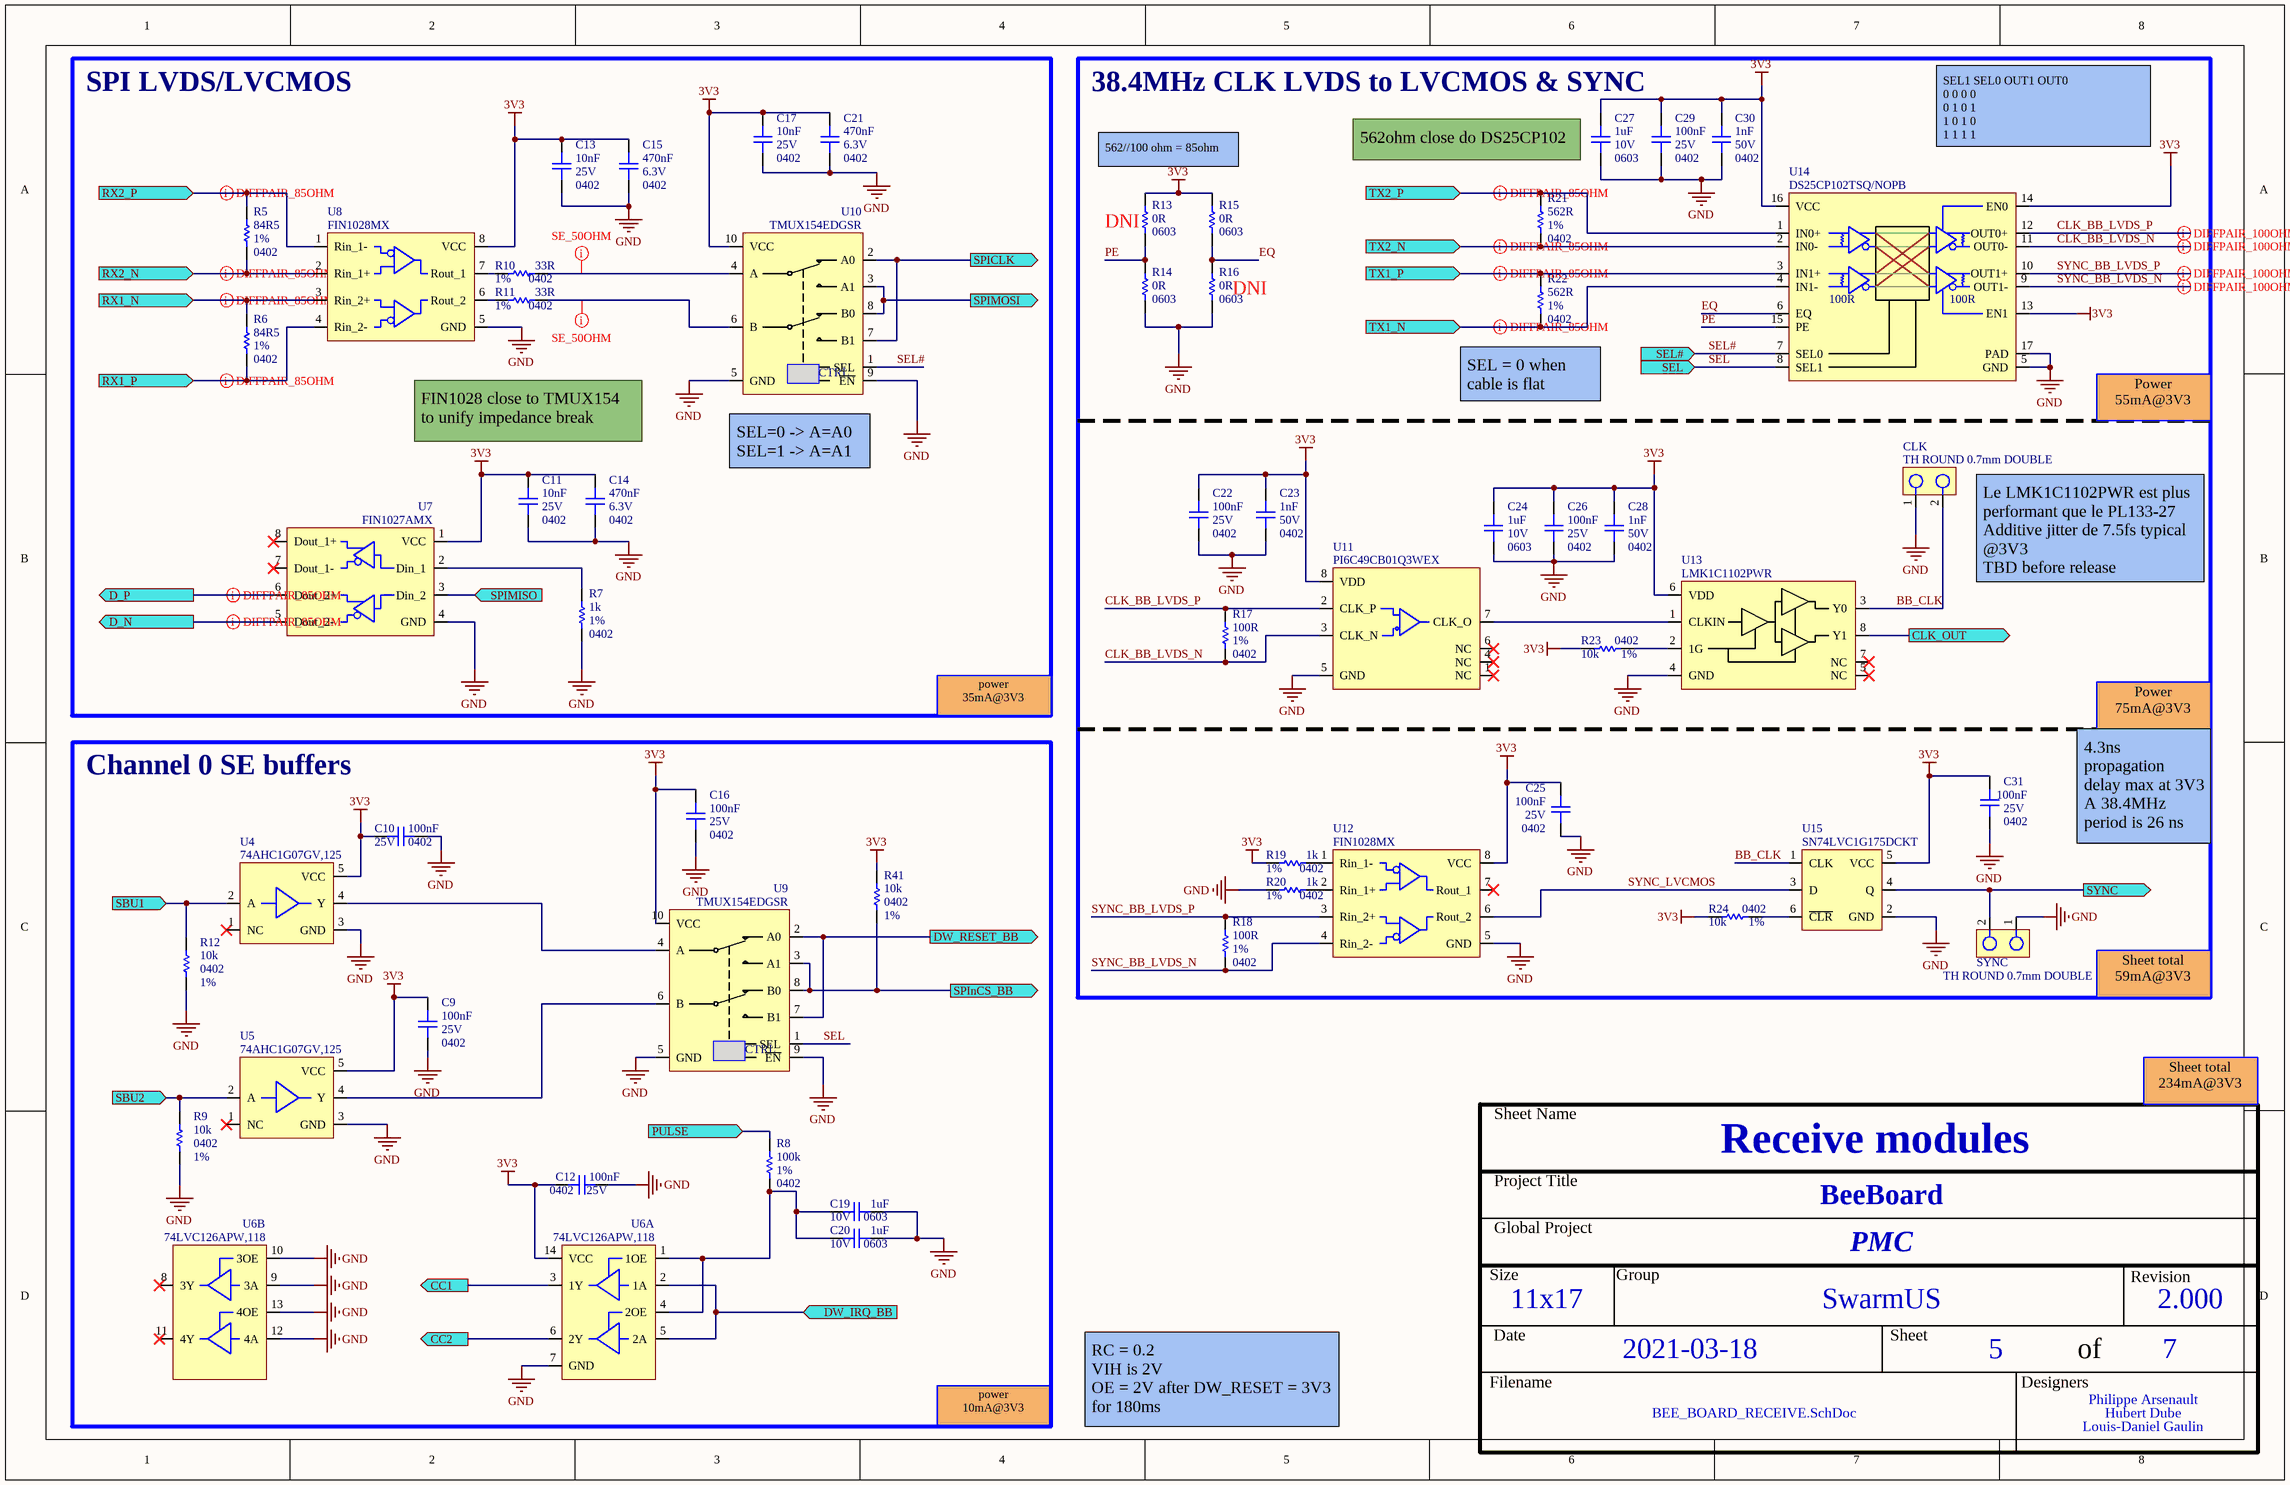
[diagram p3: BEE_BOARD_RECEIVE.SchDoc]

### Parts
(Parts that share a designator on the sheet are numbered #1, #2 ... from top to bottom, then left to right.)
C9  value 100nF  Package: 0402  Voltage Rating: 25V  [CAP_CER_0402]  (hidden comment: CGA2B3X7R1E104K050BB)
C10  value 100nF  Package: 0402  Voltage Rating: 25V  [CAP_CER_0402]  (hidden comment: CGA2B3X7R1E104K050BB)
C11  value 10nF  Package: 0402  Voltage Rating: 25V  [CAP_CER_0402]  (hidden comment: CL05B103KA5NNNC)
C12  value 100nF  Package: 0402  Voltage Rating: 25V  [CAP_CER_0402]  (hidden comment: CGA2B3X7R1E104K050BB)
C13  value 10nF  Package: 0402  Voltage Rating: 25V  [CAP_CER_0402]  (hidden comment: CL05B103KA5NNNC)
C14  value 470nF  Package: 0402  Voltage Rating: 6.3V  [CAP_CER_0402]  (hidden comment: JMK105B7474KVHF)
C15  value 470nF  Package: 0402  Voltage Rating: 6.3V  [CAP_CER_0402]  (hidden comment: JMK105B7474KVHF)
C16  value 100nF  Package: 0402  Voltage Rating: 25V  [CAP_CER_0402]  (hidden comment: CGA2B3X7R1E104K050BB)
C17  value 10nF  Package: 0402  Voltage Rating: 25V  [CAP_CER_0402]  (hidden comment: CL05B103KA5NNNC)
C19  value 1uF  Package: 0603  Voltage Rating: 10V  [CAP_CER_0603]  (hidden comment: C0603C105K8PACTU)
C20  value 1uF  Package: 0603  Voltage Rating: 10V  [CAP_CER_0603]  (hidden comment: C0603C105K8PACTU)
C21  value 470nF  Package: 0402  Voltage Rating: 6.3V  [CAP_CER_0402]  (hidden comment: JMK105B7474KVHF)
C22  value 100nF  Package: 0402  Voltage Rating: 25V  [CAP_CER_0402]  (hidden comment: CGA2B3X7R1E104K050BB)
C23  value 1nF  Package: 0402  Voltage Rating: 50V  [CAP_CER_0402]  (hidden comment: CC0402KRX7R9BB102)
C24  value 1uF  Package: 0603  Voltage Rating: 10V  [CAP_CER_0603]  (hidden comment: C0603C105K8PACTU)
C25  value 100nF  Package: 0402  Voltage Rating: 25V  [CAP_CER_0402]  (hidden comment: CGA2B3X7R1E104K050BB)
C26#2  value 100nF  Package: 0402  Voltage Rating: 25V  [CAP_CER_0402]  (hidden comment: CGA2B3X7R1E104K050BB)
C27  value 1uF  Package: 0603  Voltage Rating: 10V  [CAP_CER_0603]  (hidden comment: C0603C105K8PACTU)
C28  value 1nF  Package: 0402  Voltage Rating: 50V  [CAP_CER_0402]  (hidden comment: CC0402KRX7R9BB102)
C29  value 100nF  Package: 0402  Voltage Rating: 25V  [CAP_CER_0402]  (hidden comment: CGA2B3X7R1E104K050BB)
C30  value 1nF  Package: 0402  Voltage Rating: 50V  [CAP_CER_0402]  (hidden comment: CC0402KRX7R9BB102)
C31  value 100nF  Package: 0402  Voltage Rating: 25V  [CAP_CER_0402]  (hidden comment: CGA2B3X7R1E104K050BB)
CLK  TH ROUND 0.7mm DOUBLE  [TPO_TH_ROUND_0.7mm_DOUBLE]  (no BOM)
R5  value 84R5  Tolerance: 1%  Package: 0402  [RES_0402]  (hidden comment: RC0402FR-0784R5L)
R6  value 84R5  Tolerance: 1%  Package: 0402  [RES_0402]  (hidden comment: RC0402FR-0784R5L)
R7  value 1k  Tolerance: 1%  Package: 0402  [RES_0402]  (hidden comment: RC0402FR-071KL)
R8  value 100k  Tolerance: 1%  Package: 0402  [RES_0402]  (hidden comment: RC0402FR-07100KL)
R9  value 10k  Tolerance: 1%  Package: 0402  [RES_0402]  (hidden comment: RC0402FR-0710KL)
R10  value 33R  Tolerance: 1%  Package: 0402  [RES_0402]  (hidden comment: RC0402FR-0733RL)
R11  value 33R  Tolerance: 1%  Package: 0402  [RES_0402]  (hidden comment: RC0402FR-0733RL)
R12  value 10k  Tolerance: 1%  Package: 0402  [RES_0402]  (hidden comment: RC0402FR-0710KL)
R13  value 0R  Assembly Note: DNI  Package: 0603  [RES_0603]  (hidden comment: RC0603JR-070RL)
R14  value 0R  Package: 0603  [RES_0603]  (hidden comment: RC0603JR-070RL)
R15#2  value 0R  Package: 0603  [RES_0603]  (hidden comment: RC0603JR-070RL)
R16  value 0R  Assembly Note: DNI  Package: 0603  [RES_0603]  (hidden comment: RC0603JR-070RL)
R17  value 100R  Tolerance: 1%  Package: 0402  [RES_0402]  (hidden comment: RC0402FR-07100RP)
R18  value 100R  Tolerance: 1%  Package: 0402  [RES_0402]  (hidden comment: RC0402FR-07100RP)
R19  value 1k  Tolerance: 1%  Package: 0402  [RES_0402]  (hidden comment: RC0402FR-071KL)
R20  value 1k  Tolerance: 1%  Package: 0402  [RES_0402]  (hidden comment: RC0402FR-071KL)
R21  value 562R  Tolerance: 1%  Package: 0402  [RES_0402]  (hidden comment: RMCF0402FT562R)
R22  value 562R  Tolerance: 1%  Package: 0402  [RES_0402]  (hidden comment: RMCF0402FT562R)
R23  value 10k  Tolerance: 1%  Package: 0402  [RES_0402]  (hidden comment: RC0402FR-0710KL)
R24  value 10k  Tolerance: 1%  Package: 0402  [RES_0402]  (hidden comment: RC0402FR-0710KL)
R41  value 10k  Tolerance: 1%  Package: 0402  [RES_0402]  (hidden comment: RC0402FR-0710KL)
SYNC  TH ROUND 0.7mm DOUBLE  [TPO_TH_ROUND_0.7mm_DOUBLE]  (no BOM)
U4  74AHC1G07GV,125  [LOG_BUF_ 74AHC1G07GV,125]
U5  74AHC1G07GV,125  [LOG_BUF_ 74AHC1G07GV,125]
U6  74LVC126APW,118  [LOG_BUF_74LVC126APW,118]  (parts A,B of 2)
U7  FIN1027AMX  [COM_XCV_FIN1027AMCOM]
U8  FIN1028MX  [COM_XCV_FIN1028MX]
U9  TMUX154EDGSR  [LOG_MUX_TMUX154EDGSR]
U10  TMUX154EDGSR  [LOG_MUX_TMUX154EDGSR]
U11  PI6C49CB01Q3WEX  [TIM_BUF_PI6C49CB01Q3WEX]
U12  FIN1028MX  [COM_XCV_FIN1028MX]
U13  LMK1C1102PWR  [COM_BUF_LMK1C1102PWR]
U14  DS25CP102TSQ/NOPB  [TIM_MUX_DS25CP102TSQ/NOPB]
U15  SN74LVC1G175DCKT  [LOG_FLIPFLOP_SN74LVC1G175DCKT]

### Blocks framed on the sheet
SPI LVDS/LVCMOS: C11 C13-C15 C17 C21 R5-R7 R10 R11 U7 U8 U10
38.4MHz CLK LVDS to LVCMOS & SYNC: C22-C25 C26#2 C27-C31 CLK R13 R14 R15#2 R16-R24 SYNC U11-U15
Channel 0 SE buffers: C9 C10 C12 C16 C19 C20 R8 R9 R12 R41 U4-U6 U9

### Ports
CC1 (out), CC2 (out), CLK_OUT (out), D_N (out), D_P (out), DW_IRQ_BB (in), DW_RESET_BB (out), PULSE (in), RX1_N (in), RX1_P (in), RX2_N (in), RX2_P (in), SBU1 (in), SBU2 (in), SEL (in), SEL# (in), SPICLK (out), SPIMISO (in), SPIMOSI (out), SPInCS_BB (out), SYNC (out), TX1_N (in), TX1_P (in), TX2_N (in), TX2_P (in)

### Nets
3V3: C9.2 C10.2 C11.2 C12.1 C13.2 C14.2 C15.2 C16.2 C17.2 C21.2 C22.2 C23.2 C24.1 C25.2 C26#2.2 C27.1 C28.2 C29.2 C30.2 C31.1 R13.2 R15#2.2 R19.2 R23.2 R24.2 R41.2 U4.5(VCC) U5.5(VCC) U6.14(VCC) U7.1(VCC) U8.8(VCC) U9.10(VCC) U10.10(VCC) U11.8(VDD) U12.8(VCC) U13.6(VDD) U14.13(EN1) U14.14(EN0) U14.16(VCC) U15.5(VCC)
GND: C9.1 C10.1 C11.1 C12.2 C13.1 C14.1 C15.1 C16.1 C17.1 C19.2 C20.2 C21.1 C22.1 C23.1 C24.2 C25.1 C26#2.1 C27.2 C28.1 C29.1 C30.1 C31.2 CLK.1 R7.1 R9.2 R12.2 R14.1 R16.1 R20.2 SYNC.1 U4.3(GND) U5.3(GND) U6.7(GND) U6.9(3A) U6.10(3OE) U6.12(4A) U6.13(4OE) U7.4(GND) U8.5(GND) U9.5(GND) U9.9(~{EN}) U10.5(GND) U10.9(~{EN}) U11.5(GND) U12.5(GND) U13.4(GND) U14.5(GND) U14.17(PAD) U15.2(GND)
BB_CLK: CLK.2 U13.3(Y0) U15.1(CLK)
CC1: U6.3(1Y) ; port CC1
CC2: U6.6(2Y) ; port CC2
CLK_BB_LVDS_N: R17.1 U11.3(CLK_N) U14.11(OUT0-)
CLK_BB_LVDS_P: R17.2 U11.2(CLK_P) U14.12(OUT0+)
CLK_OUT: U13.8(Y1) ; port CLK_OUT
D_N: U7.5(Dout_2-) ; port D_N
D_P: U7.6(Dout_2+) ; port D_P
DW_IRQ_BB: U6.2(1A) U6.5(2A) ; port DW_IRQ_BB
DW_RESET_BB: U9.2(A0) U9.7(B1) ; port DW_RESET_BB
EQ: R15#2.1 R16.2 U14.6(EQ)
PE: R13.1 R14.2 U14.15(PE)
PULSE: R8.2 ; port PULSE
RX1_N: R6.2 U8.3(Rin_2+) ; port RX1_N
RX1_P: R6.1 U8.4(Rin_2-) ; port RX1_P
RX2_N: R5.1 U8.2(Rin_1+) ; port RX2_N
RX2_P: R5.2 U8.1(Rin_1-) ; port RX2_P
SBU1: R12.1 U4.2(A) ; port SBU1
SBU2: R9.1 U5.2(A) ; port SBU2
SEL: U9.1(SEL) U14.8(SEL1) ; port SEL
SEL#: U10.1(SEL) U14.7(SEL0) ; port SEL#
SPICLK: U10.2(A0) U10.7(B1) ; port SPICLK
SPIMISO: U7.3(Din_2) ; port SPIMISO
SPIMOSI: U10.3(A1) U10.8(B0) ; port SPIMOSI
SPInCS: R41.1 U9.3(A1) U9.8(B0) ; port SPInCS_BB
SYNC: SYNC.2 U15.4(Q) ; port SYNC
SYNC_BB_LVDS_N: R18.1 U12.4(Rin_2-) U14.9(OUT1-)
SYNC_BB_LVDS_P: R18.2 U12.3(Rin_2+) U14.10(OUT1+)
SYNC_LVCMOS: U12.6(Rout_2) U15.3(D)
TX1_N: R22.1 U14.4(IN1-) ; port TX1_N
TX1_P: R22.2 U14.3(IN1+) ; port TX1_P
TX2_N: R21.1 U14.2(IN0-) ; port TX2_N
TX2_P: R21.2 U14.1(IN0+) ; port TX2_P
NetC19_1: C19.1 C20.1 R8.1 U6.1(1OE) U6.4(2OE)
NetR7_2: R7.2 U7.2(Din_1)
NetR10_1: R10.1 U10.4(A)
NetR10_2: R10.2 U8.7(Rout_1)
NetR11_1: R11.1 U10.6(B)
NetR11_2: R11.2 U8.6(Rout_2)
NetR19_1: R19.1 U12.1(Rin_1-)
NetR20_1: R20.1 U12.2(Rin_1+)
NetR23_1: R23.1 U13.2(1G)
NetR24_1: R24.1 U15.6(~{CLR})
NetU4_4: U4.4(Y) U9.4(A)
NetU5_4: U5.4(Y) U9.6(B)
NetU11_7: U11.7(CLK_O) U13.1(CLKIN)

Not connected (* = marked no-connect by the designer): U4 1(NC)*; U5 1(NC)*; U6 8(3Y)* 11(4Y)*; U7 7(Dout_1-)* 8(Dout_1+)*; U11 1(NC)* 4(NC)* 6(NC)*; U12 7(Rout_1)*; U13 5(NC)* 7(NC)*

### Layout directives
differential pair; differential pair class DIFF_85; net class TX: TX1_N, TX1_P, TX2_N, TX2_P
differential pair; differential pair class DIFF_100: CLK_BB_LVDS_N, CLK_BB_LVDS_P, SYNC_BB_LVDS_N, SYNC_BB_LVDS_P
differential pair; differential pair class DIFF_85: D_N, D_P, RX1_N, RX1_P, RX2_N, RX2_P
net class SE_50OHM: NetR10_1, NetR11_1

### Notes on the sheet
- 562//100 ohm = 85ohm
- (near C27) 562ohm close do DS25CP102
- SEL1	SEL0	OUT1	OUT0
  0	0	0	0
  0	1	0	1
  1	0	1	0
  1	1	1	1
- FIN1028 close to TMUX154 to unify impedance break
- (near R22) SEL = 0 when cable is flat
- Power
  55mA@3V3
- (near U10) SEL=0 -> A=A0
  SEL=1 -> A=A1
- (near CLK) Le LMK1C1102PWR est plus performant que le PL133-27
  Additive jitter de 7.5fs typical @3V3
  TBD before release
- power
  35mA@3V3
- Power
  75mA@3V3
- 4.3ns propagation delay max at 3V3
  A 38.4MHz period is 26 ns
- Sheet total
  59mA@3V3
- Sheet total
  234mA@3V3
- power
  10mA@3V3
- RC = 0.2
  VIH is 2V
  OE = 2V after DW_RESET = 3V3 for 180ms
- Sheet Name
- Project Title
- Global Project
- Size
- Group
- Revision
- Date
- Sheet
- of
- Filename
- Designers
- (in symbol LOG_MUX_TMUX154EDGSR) CTRL
- (in symbol TIM_MUX_DS25CP102TSQ/NOPB) 100R

### Library data of the parts
C9 C10 C12 C16 C22 C25 C26#2 C29 C31 = CAP_CER_CGA2B3X7R1E104K050BB: as C6 on sheet BEE_BOARD_POWER; Assembly Type: SMD; CreatedBy/Date: Nicolas Roy 2018-11-07; Current Rating: *; HelpURL: https://product.tdk.com/info/en/catalog/datasheets/mlcc_automotive_general_en.pdf; Manufacturer #2: *; Note: *; Part Number #1: CGA2B3X7R1E104K050BB; Part Number #2: *; Power Max: *; Temperature: -55°C ~ 125°C; Tolerance: 10%; VerifiedBy: Nicolas V. (2019-01-22); Supplier 1: Digi-Key; Supplier Part Number 1: 445-6902-1-ND; Cryo: UNKNOWN
C11 C13 C17 = CAP_CER_CL05B103KA5NNNC: CAP - CER 10nF 10% 25V X7R - 0402; Manufacturer #1: Samsung Electro-Mechanics; GRAMS Lib Spec: 2.8; Magnetic Material: YES; Polarized: NO; Cryo: UNKNOWN; Assembly Type: SMD; CreatedBy/Date: Romain Espagnet 2018-07-16; Current Rating: *; HelpURL: http://www.samsungsem.com/kr/support/product-search/mlcc/__icsFiles/afieldfile/2018/07/13/CL05B103KA5NNNC.pdf; Manufacturer #2: Murata Electronics North America; Note: *; Part Number #1: CL05B103KA5NNNC; Part Number #2: GRM155R71E103KA01D; Power Max: *; Temperature: -55°C ~ 125°C; Tolerance: 10%; VerifiedBy: Jonathan Bouchard 2018-07-30; Supplier 1: Digi-Key; Supplier Part Number 1: 1276-1057-1-ND
C14 C15 C21 = CAP_CER_JMK105B7474KVHF: CAP - CER 470nF 6.3V X7R - 0402; Manufacturer #1: Taiyo Yuden; Tolerance: 10%; GRAMS Lib Spec: 2.8; Magnetic Material: UNKNOWN; Polarized: NO; Current Rating: *; Power Max: *; HelpURL: https://ds.yuden.co.jp/TYCOMPAS/ut/detail?pn=JMK105B7474KVHF%20&u=M; CreatedBy/Date: Nicolas (2019-06-21); VerifiedBy: Nicolas V. (2019-06-21); Temperature: -55°C ~ 125°C; Manufacturer #2: *; Note: *; Assembly Type: SMD; Part Number #2: *; Part Number #1: JMK105B7474KVHF; Supplier 1: Digi-Key; Supplier Part Number 1: 587-3765-1-ND; Cryo: UNKNOWN
C19 C20 C24 C27 = CAP_CER_C0603C105K8PACTU: as C2 on sheet BEE_BOARD_POWER; Tolerance: 10%; Current Rating: *; Power Max: *; HelpURL: https://content.kemet.com/datasheets/KEM_C1006_X5R_SMD.pdf; CreatedBy/Date: Hubert Dube - 21/07/20; VerifiedBy: Louis-Daniel Gaulin - 21/07/20; Temperature: -55°C ~ 85°C; Manufacturer #2: *; Assembly Type: SMD; Part Number #2: *; Part Number #1: C0603C105K8PACTU; Cryo: UNKNOWN; Supplier 1: Digi-Key; Supplier Part Number 1: 399-3118-1-ND
C23 C28 C30 = CAP_CER_CC0402KRX7R9BB102: CAP - CER 1nF 10% 50V X7R - 0402; Manufacturer #1: Yageo; GRAMS Lib Spec: 2.8; Magnetic Material: UNKNOWN; Polarized: NO; Assembly Type: SMD; CreatedBy/Date: Jonathan Bouchard 2019-04-06; Current Rating: *; HelpURL: http://www.yageo.com/documents/recent/UPY-GPHC_X7R_6.3V-to-50V_18.pdf; Manufacturer #2: *; Note: *; Part Number #1: CC0402KRX7R9BB102; Part Number #2: *; Power Max: *; Temperature: -55°C ~ 125°C; Tolerance: 10%; VerifiedBy: Nicolas V. (2019-04-30); Supplier 1: Digi-Key; Supplier Part Number 1: 311-1036-1-ND; Cryo: UNKNOWN
CLK SYNC = TPO_TH_ROUND_0.7mm_DOUBLE: TPO - TH round 0.7mm double - 2-SMD; GRAMS Lib Spec: 2.8; Tolerance: -; Voltage Rating: -; Current Rating: -; Power Max: -; HelpURL: -; CreatedBy/Date: Philippe Arsenault / 20-04-2021; VerifiedBy: Louis-Daniel Gaulin / 29-04-2021; Temperature: -; Package: 2-SMD; Manufacturer #1: -; Manufacturer #2: -; Note: -; Assembly Type: TH; Part Number #2: -; Part Number #1: -; Magnetic Material: -; Polarized: -; Supplier 1: -; Supplier Part Number 1: -
R5 R6 = RES_RC0402FR-0784R5L: RES - 84R5 1% 1/16W - 0402; Manufacturer #1: Yageo; GRAMS Lib Spec: 2.8c; Magnetic Material: Unknown; Polarized: No; Voltage Rating: 50V; Assembly Type: SMD; CreatedBy/Date: Philippe Arsenault/ 2021-03-31; Current Rating: *; HelpURL: https://www.yageo.com/upload/media/product/productsearch/datasheet/rchip/PYu-RC_Group_51_RoHS_L_11.pdf; Manufacturer #2: *; Note: *; Part Number #1: RC0402FR-0784R5L; Part Number #2: *; Power Max: 1/16W; Temperature: -55°C ~ 155°C; Supplier 1: Digi-Key; Supplier Part Number 1: YAG3246CT-ND
R7 R19 R20 = RES_RC0402FR-071KL: RES - 1K OHM 1% 1/16W - 0402; Manufacturer #1: Yageo; GRAMS Lib Spec: 2.8; Magnetic Material: YES; Polarized: NO; Voltage Rating: 50V; Cryo: UNKNOWN; Assembly Type: SMD; CreatedBy/Date: Jonathan Bouchard 2018-07-05; Current Rating: *; HelpURL: http://www.yageo.com/documents/recent/PYu-RC_Group_51_RoHS_L_9.pdf; Manufacturer #2: *; Note: *; Part Number #1: RC0402FR-071KL; Part Number #2: *; Power Max: 1/16W; Temperature: -55°C ~ 155°C; VerifiedBy: Arnaud Samson 16-07-18; Supplier 1: Digi-Key; Supplier Part Number 1: 311-1.00KLRCT-ND
R8 = RES_RC0402FR-07100KL: as R40 on sheet BEE_BOARD_POWER; Assembly Type: SMD; CreatedBy/Date: Keven Deslandes 2018-10-19; Current Rating: *; HelpURL: http://www.yageo.com/documents/recent/PYu-RC_Group_51_RoHS_L_9.pdf; Manufacturer #2: *; Part Number #1: RC0402FR-07100KL; Part Number #2: *; Power Max: 1/16W; Temperature: -55°C ~ 155°C; VerifiedBy: Caroline Paulin - 18/12/2018; Supplier 1: Digi-Key; Supplier Part Number 1: 311-100KLRCT-ND; Cryo: UNKNOWN
R9 R12 R23 R24 R41 = RES_RC0402FR-0710KL: as R3 on sheet BEE_BOARD_POWER; Assembly Type: SMD; CreatedBy/Date: Nicolas V. (2018-11-20); Current Rating: *; HelpURL: http://www.yageo.com/documents/recent/PYu-RC_Group_51_RoHS_L_9.pdf; Manufacturer #2: *; Note: *; Part Number #1: RC0402FR-0710KL; Part Number #2: *; Power Max: 1/16W; Temperature: -55°C ~ 155°C; VerifiedBy: Nicolas V. (2018-11-20); Supplier 1: Digi-Key; Supplier Part Number 1: 311-10.0KLRCT-ND; Cryo: UNKNOWN
R10 R11 = RES_RC0402FR-0733RL: RES - 33 OHM 1% 1/16W - 0402; Manufacturer #1: Yageo; GRAMS Lib Spec: 2.8c; Magnetic Material: Unknown; Polarized: NO; Voltage Rating: 50V; Assembly Type: SMD; CreatedBy/Date: Louis-Daniel Gaulin/ 14/01/2020; Current Rating: *; HelpURL: https://www.yageo.com/upload/media/product/productsearch/datasheet/rchip/PYu-RC_Group_51_RoHS_L_10.pdf; Manufacturer #2: *; Note: *; Part Number #1: RC0402FR-0733RL; Part Number #2: *; Power Max: 1/16W; Temperature: -55°C ~ 155°C; VerifiedBy: C.Paulin - 21/01/2020; Supplier 1: Digi-Key; Supplier Part Number 1: 311-33.0LRCT-ND; Cryo: UNKNOWN
R13 R14 R15#2 R16 = RES_RC0603JR-070RL: RES - 0 ohm jumper 1/10W - 0603; Manufacturer #1: Yageo; GRAMS Lib Spec: 2.8; Magnetic Material: Unknown; Polarized: No; Assembly Type: SMD; CreatedBy/Date: L-P Gauthier 2018-10-30; Current Rating: *; HelpURL: http://www.yageo.com/documents/recent/PYu-RC_Group_51_RoHS_L_9.pdf; Manufacturer #2: *; Part Number #1: RC0603JR-070RL; Part Number #2: *; Power Max: 1/10W; Temperature: -55°C ~ 155°C; VerifiedBy: Caroline Paulin  - 5/11/2018; Voltage Rating: -; Supplier 1: Digi-Key; Supplier Part Number 1: 311-0.0GRCT-ND; Cryo: UNKNOWN
R17 R18 = RES_RC0402FR-07100RP: RES - 100R OHM 1% 1/16W - 0402; Manufacturer #1: Yageo; GRAMS Lib Spec: 2.8; Magnetic Material: YES; Polarized: NO; Voltage Rating: 50V; Cryo: UNKNOWN; Assembly Type: SMD; CreatedBy/Date: Jonathan Bouchard 2018-07-05; Current Rating: *; HelpURL: http://www.yageo.com/documents/recent/PYu-RC_Group_51_RoHS_L_9.pdf; Manufacturer #2: *; Note: *; Part Number #1: RC0402FR-07100RP; Part Number #2: *; Power Max: 1/16W; Temperature: -55°C ~ 155°C; VerifiedBy: Arnaud Samson 16-07-18; Supplier 1: Digi-Key; Supplier Part Number 1: YAG1248CT-ND
R21 R22 = RES_RMCF0402FT562R: RES - 562R ±1% 0.063W, 1/16W Chip Resistor 0402; Manufacturer #1: Stackpole Electronics Inc.; GRAMS Lib Spec: 2.8c; Magnetic Material: Unknown; Polarized: No; Voltage Rating: 50V; Assembly Type: SMD; CreatedBy/Date: Philippe Arsenault/2021-04-02; Current Rating: *; HelpURL: https://www.seielect.com/catalog/sei-rmcf_rmcp.pdf; Manufacturer #2: *; Note: *; Part Number #1: RMCF0402FT562R; Part Number #2: *; Power Max: 1/16W; Temperature: -55°C ~ 155°C; Supplier 1: Digi-Key; Supplier Part Number 1: RMCF0402FT562RCT-ND
U4 U5 = LOG_BUF_74AHC1G07GV,125: LOG_BUF - Buffer non-inverting Open Drain - SC-74A; Manufacturer #1: Nexperia USA Inc.; Voltage Rating: 2V ~ 5.5V; Current Rating: 8mA; GRAMS Lib Spec: 2.8; Magnetic Material: Unknown; Polarized: Yes; Power Max: -; HelpURL: https://assets.nexperia.com/documents/data-sheet/74AHC1G07.pdf; CreatedBy/Date: Louis-Daniel Gaulin / 07-04-2021; VerifiedBy: Philippe Arsenault/2021-04-08; Temperature: -40°C ~ 125°C (TA); Package: SC-74A; Assembly Type: SMD; Part Number #1: 74AHC1G07GV,125; Supplier 1: Digi-Key; Supplier Part Number 1: 1727-6761-1-ND
U6 = LOG_BUF_74LVC126APW,118: LOG_BUF - Quad Buffer non-inverting 3-States - 14-TSSOP; Manufacturer #1: Nexperia USA Inc.; Voltage Rating: 1.65V ~ 3.6V; Current Rating: 100mA (supply) - 24mA (output); Power Max: 500mW; GRAMS Lib Spec: 2.8; Magnetic Material: Unknown; Polarized: Yes; HelpURL: https://assets.nexperia.com/documents/data-sheet/74LVC126A.pdf; CreatedBy/Date: Louis-Daniel Gaulin / 11-04-2021; VerifiedBy: Philippe Arsenault/2021-04-14; Temperature: -40°C ~ 125°C (TA); Package: 14-TSSOP; Assembly Type: SMD; Part Number #1: 74LVC126APW,118; Supplier 1: Digi-Key; Supplier Part Number 1: 1727-5979-1-ND
U7 = COM_XCV_FIN1027AMX: COM_XCV - 3V3 LVCMOS to LVDS, 2 bits, High-SPEED, DIFF driver - SOIC-8; Manufacturer #1: ON Semiconductor; Value: 600Mbps; Voltage Rating: 3V ~ 3.6V; Current Rating: 17mA; Power Max: 56mW; GRAMS Lib Spec: 2.8; Magnetic Material: Unknown; Polarized: YES; HelpURL: https://www.onsemi.com/pdf/datasheet/fin1027a-d.pdf; CreatedBy/Date: Philippe Arsenault/2021-04-01; VerifiedBy: Louis-Daniel Gaulin - 05/04/2021; Temperature: -40°C ~ 85°C; Package: SOIC-8; Assembly Type: SMD; Part Number #1: FIN1027AMX; Supplier 1: Digi-Key; Supplier Part Number 1: FIN1027AMXCT-ND
U8 U12 = COM_XCV_FIN1028MX: COM_XCV - 3V3 LVDS to LVCMOS, 2 bits, High-SPEED, DIFF receiver - SOIC-8; Manufacturer #1: ON Semiconductor; Value: 400Mbps; Voltage Rating: 3V ~ 3.6V; Current Rating: 9mA; Power Max: 30mW; GRAMS Lib Spec: 2.8; Magnetic Material: Unknown; Polarized: YES; HelpURL: https://www.onsemi.com/pdf/datasheet/fin1028-d.pdf; CreatedBy/Date: Philippe Arsenault/2021-04-01; VerifiedBy: Louis-Daniel Gaulin - 05/04/2021; Temperature: -40°C ~ 85°C; Package: SOIC-8; Assembly Type: SMD; Part Number #1: FIN1028MX; Supplier 1: Digi-Key; Supplier Part Number 1: FIN1028MXCT-ND
U9 U10 = LOG_MUX_TMUX154EDGSR: LOG_MUX -  SWITCH SPDT DUAL 2:1 - 10-VSSOP; Manufacturer #1: Texas Instruments; Voltage Rating: 3V ~ 4.3V; Current Rating: 10uA; Power Max: 50uW; GRAMS Lib Spec: 2.8C; Magnetic Material: Unknown; Polarized: YES; Value: -; Tolerance: -; HelpURL: https://www.ti.com/lit/ds/symlink/tmux154e.pdf?HQS=TI-null-null-digikeymode-df-pf-null-wwe&ts=1602037764538; CreatedBy/Date: Louis-Daniel Gaulin / 06-10-2020; VerifiedBy: Philippe Arsenault/2020-11-06; Temperature: -40°C ~ 85°C; Package: 10-VSSOP; Manufacturer #2: -; Note: -; Assembly Type: SMD; Part Number #2: -; Part Number #1: TMUX154EDGSR; Supplier 1: Digi-Key; Supplier Part Number 1: 296-48347-1-ND
U11 = TIM_BUF_PI6C49CB01Q3WEX: TIM_BUF - Clock Translator IC 1:1 LVDS-LVCMOS -  8-SOIC; Manufacturer #1: Diodes Incorporated; Voltage Rating: 2.375V ~ 2.625V, 3V ~ 3.6V; Current Rating: 35mA; Power Max: 126mW; GRAMS Lib Spec: 2.7; Magnetic Material: Unknown; Polarized: Yes; Value: 1:1; HelpURL: https://www.diodes.com/assets/Datasheets/PI6C49CB01Q.pdf; CreatedBy/Date: Philippe Arsenault/2021-03-26; VerifiedBy: Louis-Daniel Gaulin - 05/04/2021; Temperature: -40 to 85°C; Package: 8-SOIC; Assembly Type: SMD; Part Number #1: PI6C49CB01Q3WEX; Supplier 1: Digi-Key; Supplier Part Number 1: 31-PI6C49CB01Q3WEXCT-ND
U13 = COM_BUF_LMK1C1102PWR: COM - BUF - Clock buffer 3V3, 2V5, 1V8 2 Channel - TSSOP 8; Manufacturer #1: Texas Instruments; Voltage Rating: 1.71V ~ 1.89V, 2.375V ~ 2.625V, 3.135V ~ 3.465V; Current Rating: Input +-20mA ; Output +- 50mA; Power Max: 132mW; GRAMS Lib Spec: 2.8; Magnetic Material: Unknown; Polarized: Yes; Cryo: No; Value: *; Tolerance: *; HelpURL: https://www.ti.com/lit/ds/symlink/lmk1c1102.pdf?ts=1595262014854&ref_url=https%253A%252F%252Fwww.ti.com%252Fproduct%252FLMK1C1102%253Futm_source%253Dgoogle%2526utm_medium%253Dcpc%2526utm_campaign%253Dasc-null-null-GPN_EN-cpc-pf-google-wwe%2526utm_content%253DLMK1C1102%2526ds_k%253DLMK1C1102%2526DCM%253Dyes%2526gclid%253DCjwKCAjwgdX4BRB_EiwAg8O8HUIvo-ksMfq8YInqTklLXWuMoCGXxsnhq04Fqr4kdDFQPSc0fYG9iRoCPvAQAvD_BwE%2526gclsrc%253Daw.ds; CreatedBy/Date: Philippe Arsenault/20-07-2020; VerifiedBy: Louis-Daniel Gaulin / 23-07-2020; Temperature: –40°C to 125°C; Package: TSSOP 8 pin; Note: *; Assembly Type: SMT; Part Number #2: *; Part Number #1: LMK1C1102PWR; Supplier 1: Digi-Key; Supplier Part Number 1: 296-LMK1C1102PWRCT-ND
U14 = TIM_MUX_DS25CP102TSQ/NOPB: TIM_MUX - Crosspoint Switch 1 x 2:2 3.125Gbps - 16-WQFN (4x4); Manufacturer #1: Texas Instrument; Value: 1x2:2; Voltage Rating: 3V ~ 3.6V; Current Rating: 90mA; Power Max: 180mW; GRAMS Lib Spec: 2.8; Magnetic Material: UNKNOWN; Polarized: YES; HelpURL: https://www.ti.com/lit/ds/symlink/ds25cp102.pdf?HQS=dis-dk-null-digikeymode-dsf-pf-null-wwe&ts=1617306001217; CreatedBy/Date: Philippe Arsenault/2021-04-01; VerifiedBy: Louis-Daniel Gaulin / 08-04-2021; Temperature: -40°C ~ 85°C; Package: 16-WQFN; Assembly Type: SMD; Part Number #1: DS25CP102TSQ/NOPB; Supplier 1: Digi-Key; Supplier Part Number 1: DS25CP102TSQ/NOPBCT-ND
U15 = LOG_FLIPFLOP_SN74LVC1G175DCKT: LOG_FLIPFLOP - Single D flip-flop with Asynchronous clear - SOT-363; Manufacturer #1: Texas Instruments; Part Number #1: SN74LVC1G175DCKR; Voltage Rating: 1.65V ~ 5.5V; Current Rating: 100mA; GRAMS Lib Spec: 2.8; Magnetic Material: Unknown; Polarized: Yes; Cryo: No; Value: *; Tolerance: *; Power Max: *; HelpURL: https://www.ti.com/lit/ds/symlink/sn74lvc1g175.pdf?ts=1594769483993&ref_url=https%253A%252F%252Fwww.google.com%252F; CreatedBy/Date: Philippe Arsenault/21-07-2020; VerifiedBy: Louis-Daniel Gaulin / 03-10-2020; Temperature: -40°C ~ 125°C; Package: SOT-363; Manufacturer #2: *; Note: *; Assembly Type: SMD; Part Number #2: *; Supplier 1: Digi-Key; Supplier Part Number 1: 296-16998-1-ND